# Altium project miniBackplane.PrjPCB (part 1 of 2)
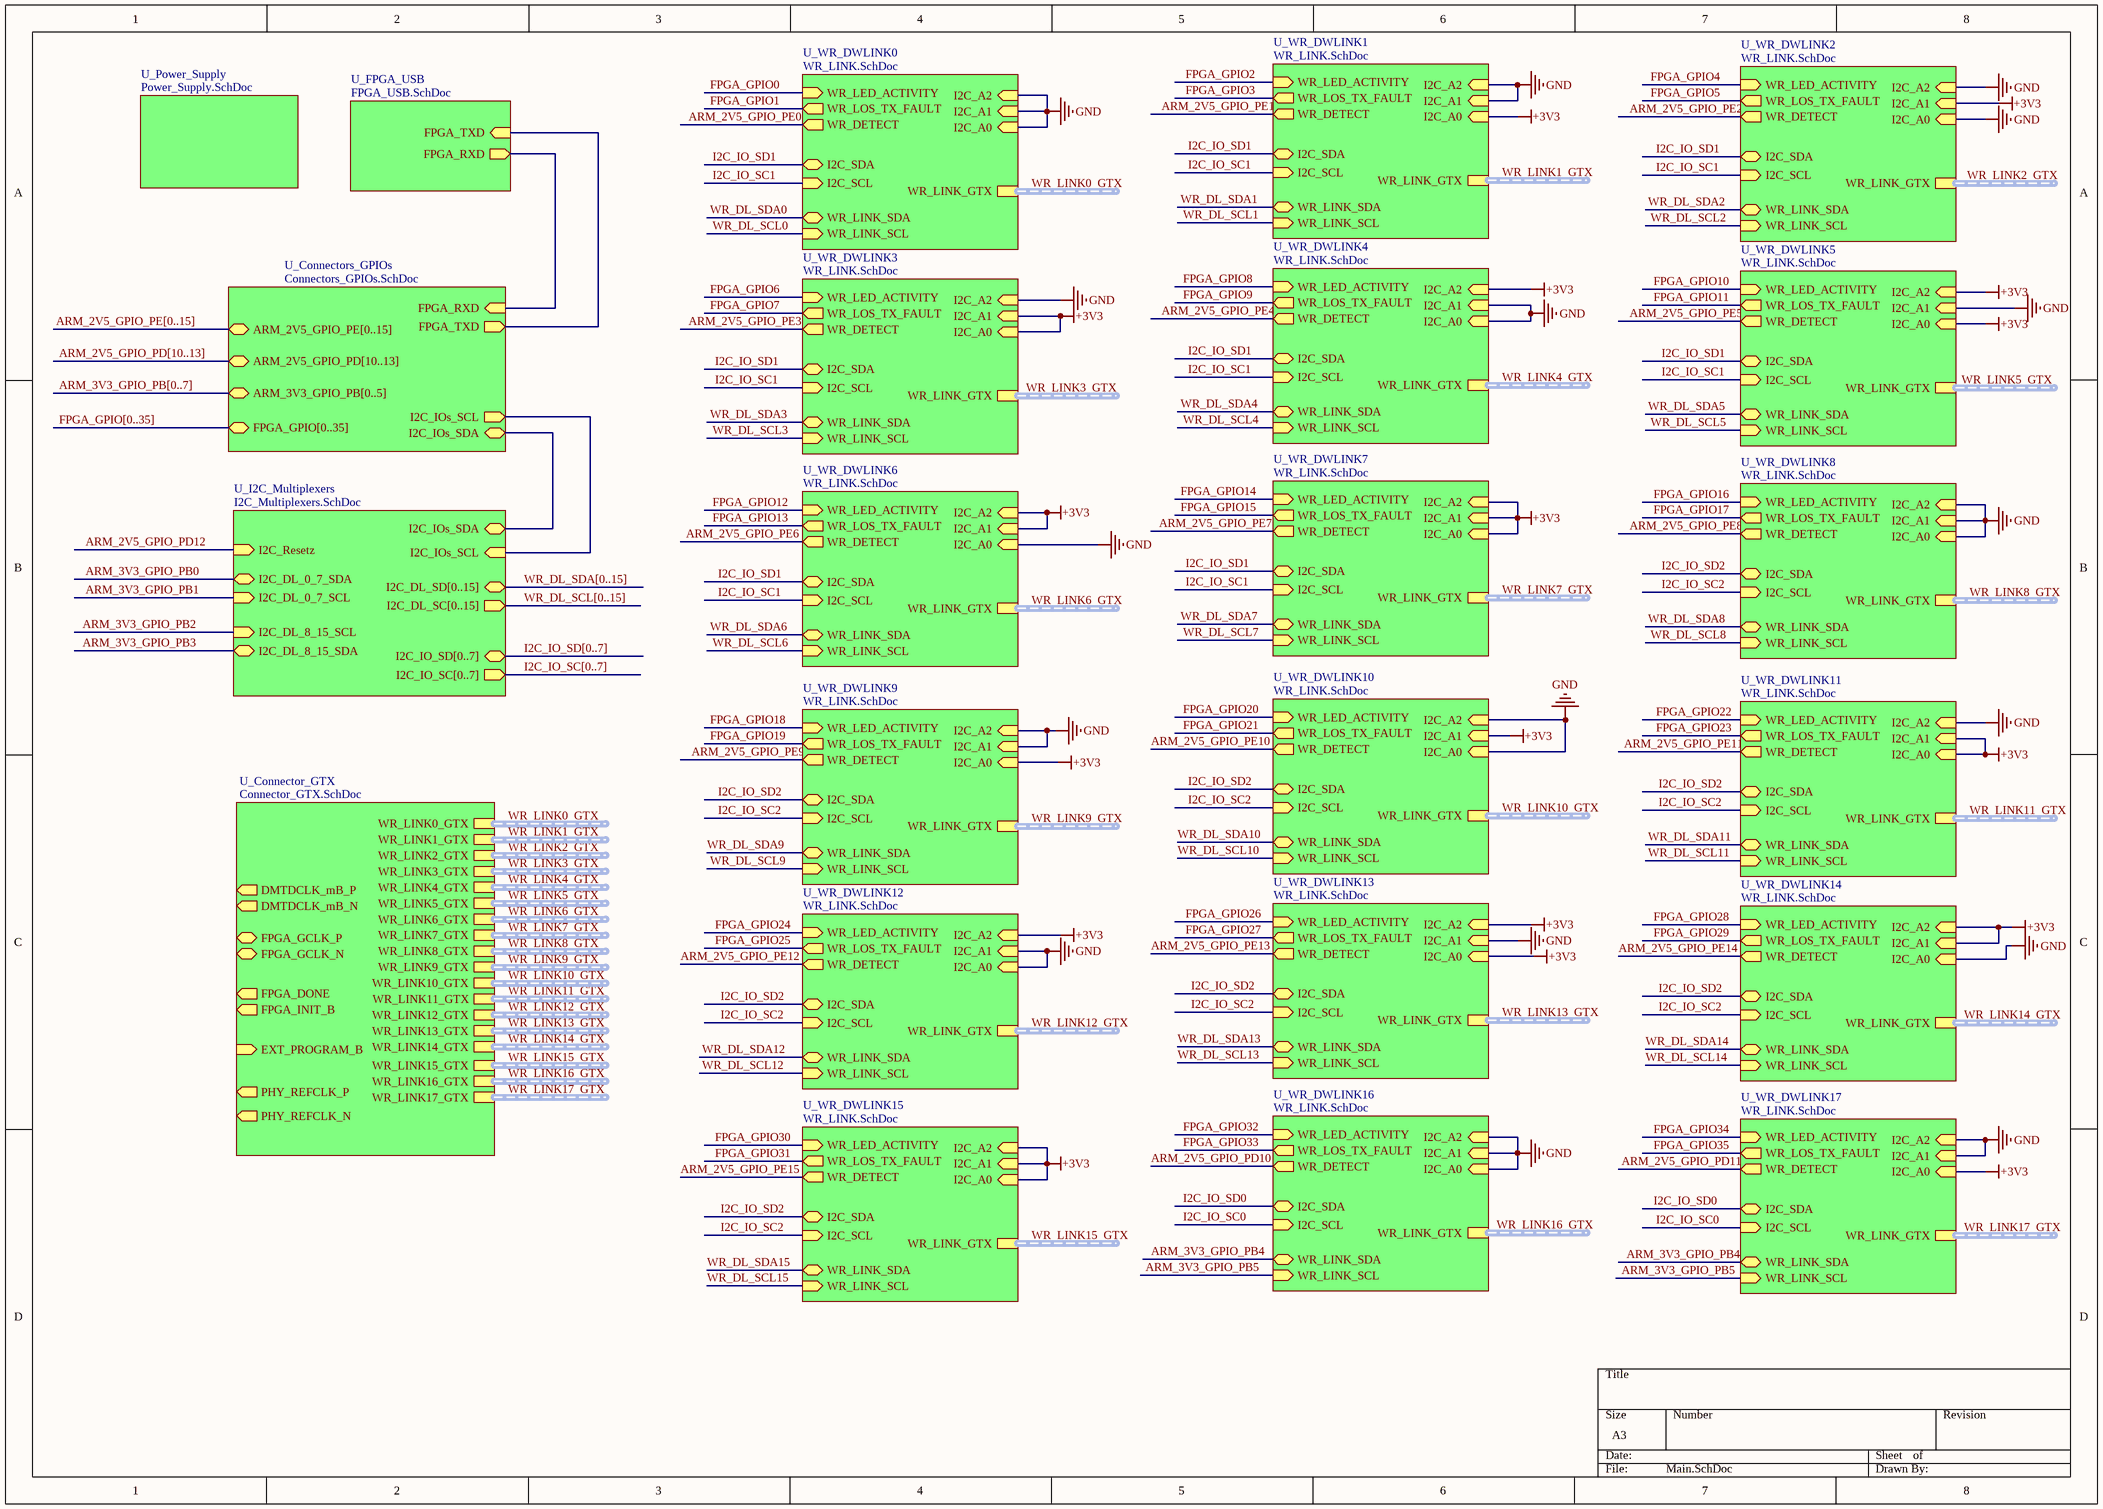
[diagram p0: Main.SchDoc]
8 sheets, 525 parts. Net scope: hierarchical (ports join the sheet entries above them; power ports are global).
Sheets:
  Main.SchDoc
    U_Connector_GTX = Connector_GTX.SchDoc
    U_WR_DWLINK0 = WR_LINK.SchDoc
      U_SFP = SFP.SchDoc
    U_I2C_Multiplexers = I2C_Multiplexers.SchDoc
    U_Connectors_GPIOs = Connectors_GPIOs.SchDoc
    U_Power_Supply = Power_Supply.SchDoc
    U_FPGA_USB = FPGA_USB.SchDoc
    U_WR_DWLINK1 = WR_LINK.SchDoc
      U_SFP = SFP.SchDoc
    U_WR_DWLINK2 = WR_LINK.SchDoc
      U_SFP = SFP.SchDoc
    U_WR_DWLINK3 = WR_LINK.SchDoc
      U_SFP = SFP.SchDoc
    U_WR_DWLINK4 = WR_LINK.SchDoc
      U_SFP = SFP.SchDoc
    U_WR_DWLINK5 = WR_LINK.SchDoc
      U_SFP = SFP.SchDoc
    U_WR_DWLINK8 = WR_LINK.SchDoc
      U_SFP = SFP.SchDoc
    U_WR_DWLINK11 = WR_LINK.SchDoc
      U_SFP = SFP.SchDoc
    U_WR_DWLINK14 = WR_LINK.SchDoc
      U_SFP = SFP.SchDoc
    U_WR_DWLINK17 = WR_LINK.SchDoc
      U_SFP = SFP.SchDoc
    U_WR_DWLINK16 = WR_LINK.SchDoc
      U_SFP = SFP.SchDoc
    U_WR_DWLINK13 = WR_LINK.SchDoc
      U_SFP = SFP.SchDoc
    U_WR_DWLINK10 = WR_LINK.SchDoc
      U_SFP = SFP.SchDoc
    U_WR_DWLINK7 = WR_LINK.SchDoc
      U_SFP = SFP.SchDoc
    U_WR_DWLINK6 = WR_LINK.SchDoc
      U_SFP = SFP.SchDoc
    U_WR_DWLINK9 = WR_LINK.SchDoc
      U_SFP = SFP.SchDoc
    U_WR_DWLINK12 = WR_LINK.SchDoc
      U_SFP = SFP.SchDoc
    U_WR_DWLINK15 = WR_LINK.SchDoc
      U_SFP = SFP.SchDoc

## Sheet Main.SchDoc
size A3

### Sub-sheets
U_Connector_GTX = Connector_GTX.SchDoc: DMTDCLK_mB_P (out), DMTDCLK_mB_N (out), FPGA_GCLK_P (bidir), FPGA_GCLK_N (bidir), EXT_PROGRAM_B (in), FPGA_DONE (out), FPGA_INIT_B (out), PHY_REFCLK_P (out), PHY_REFCLK_N (out), WR_LINK0_GTX (harness WR_LINK_GTX), WR_LINK1_GTX (harness WR_LINK_GTX), WR_LINK2_GTX (harness WR_LINK_GTX), WR_LINK3_GTX (harness WR_LINK_GTX), WR_LINK4_GTX (harness WR_LINK_GTX), WR_LINK5_GTX (harness WR_LINK_GTX), WR_LINK6_GTX (harness WR_LINK_GTX), WR_LINK7_GTX (harness WR_LINK_GTX), WR_LINK8_GTX (harness WR_LINK_GTX), WR_LINK9_GTX (harness WR_LINK_GTX), WR_LINK10_GTX (harness WR_LINK_GTX), WR_LINK11_GTX (harness WR_LINK_GTX), WR_LINK17_GTX (harness WR_LINK_GTX), WR_LINK16_GTX (harness WR_LINK_GTX), WR_LINK15_GTX (harness WR_LINK_GTX), WR_LINK14_GTX (harness WR_LINK_GTX), WR_LINK13_GTX (harness WR_LINK_GTX), WR_LINK12_GTX (harness WR_LINK_GTX)
U_Connectors_GPIOs = Connectors_GPIOs.SchDoc: FPGA_RXD (in), FPGA_TXD (out), ARM_2V5_GPIO_PE[0..15] (bidir), FPGA_GPIO[0..35] (bidir), I2C_IOs_SCL (out), I2C_IOs_SDA (bidir), ARM_2V5_GPIO_PD[10..13] (bidir), ARM_3V3_GPIO_PB[0..5] (bidir)
U_FPGA_USB = FPGA_USB.SchDoc: FPGA_RXD (out), FPGA_TXD (in)
U_I2C_Multiplexers = I2C_Multiplexers.SchDoc: I2C_DL_SD[0..15] (bidir), I2C_DL_SC[0..15] (out), I2C_IO_SD[0..7] (bidir), I2C_IO_SC[0..7] (out), I2C_DL_0_7_SDA (bidir), I2C_DL_0_7_SCL (in), I2C_DL_8_15_SCL (in), I2C_DL_8_15_SDA (bidir), I2C_IOs_SCL (in), I2C_IOs_SDA (bidir), I2C_Resetz (in)
U_Power_Supply = Power_Supply.SchDoc: no entries
U_WR_DWLINK0 = WR_LINK.SchDoc: WR_LINK_GTX (harness WR_LINK_GTX), I2C_A0 (in), I2C_A1 (in), I2C_A2 (in), I2C_SCL (in), I2C_SDA (bidir), WR_LINK_SDA (bidir), WR_LINK_SCL (in), WR_LOS_TX_FAULT (out), WR_LED_ACTIVITY (in), WR_DETECT (out)
U_WR_DWLINK1 = WR_LINK.SchDoc: WR_LINK_GTX (harness WR_LINK_GTX), I2C_A0 (in), I2C_A1 (in), I2C_A2 (in), I2C_SCL (in), I2C_SDA (bidir), WR_LINK_SDA (bidir), WR_LINK_SCL (in), WR_LOS_TX_FAULT (out), WR_LED_ACTIVITY (in), WR_DETECT (out)
U_WR_DWLINK2 = WR_LINK.SchDoc: WR_LINK_GTX (harness WR_LINK_GTX), I2C_A0 (in), I2C_A1 (in), I2C_A2 (in), I2C_SCL (in), I2C_SDA (bidir), WR_LINK_SDA (bidir), WR_LINK_SCL (in), WR_LOS_TX_FAULT (out), WR_LED_ACTIVITY (in), WR_DETECT (out)
U_WR_DWLINK3 = WR_LINK.SchDoc: WR_LINK_GTX (harness WR_LINK_GTX), I2C_A0 (in), I2C_A1 (in), I2C_A2 (in), I2C_SCL (in), I2C_SDA (bidir), WR_LINK_SDA (bidir), WR_LINK_SCL (in), WR_LOS_TX_FAULT (out), WR_LED_ACTIVITY (in), WR_DETECT (out)
U_WR_DWLINK4 = WR_LINK.SchDoc: WR_LINK_GTX (harness WR_LINK_GTX), I2C_A0 (in), I2C_A1 (in), I2C_A2 (in), I2C_SCL (in), I2C_SDA (bidir), WR_LINK_SDA (bidir), WR_LINK_SCL (in), WR_LOS_TX_FAULT (out), WR_LED_ACTIVITY (in), WR_DETECT (out)
U_WR_DWLINK5 = WR_LINK.SchDoc: WR_LINK_GTX (harness WR_LINK_GTX), I2C_A0 (in), I2C_A1 (in), I2C_A2 (in), I2C_SCL (in), I2C_SDA (bidir), WR_LINK_SDA (bidir), WR_LINK_SCL (in), WR_LOS_TX_FAULT (out), WR_LED_ACTIVITY (in), WR_DETECT (out)
U_WR_DWLINK6 = WR_LINK.SchDoc: WR_LINK_GTX (harness WR_LINK_GTX), I2C_A0 (in), I2C_A1 (in), I2C_A2 (in), I2C_SCL (in), I2C_SDA (bidir), WR_LINK_SDA (bidir), WR_LINK_SCL (in), WR_LOS_TX_FAULT (out), WR_LED_ACTIVITY (in), WR_DETECT (out)
U_WR_DWLINK7 = WR_LINK.SchDoc: WR_LINK_GTX (harness WR_LINK_GTX), I2C_A0 (in), I2C_A1 (in), I2C_A2 (in), I2C_SCL (in), I2C_SDA (bidir), WR_LINK_SDA (bidir), WR_LINK_SCL (in), WR_LOS_TX_FAULT (out), WR_LED_ACTIVITY (in), WR_DETECT (out)
U_WR_DWLINK8 = WR_LINK.SchDoc: WR_LINK_GTX (harness WR_LINK_GTX), I2C_A0 (in), I2C_A1 (in), I2C_A2 (in), I2C_SCL (in), I2C_SDA (bidir), WR_LINK_SDA (bidir), WR_LINK_SCL (in), WR_LOS_TX_FAULT (out), WR_LED_ACTIVITY (in), WR_DETECT (out)
U_WR_DWLINK9 = WR_LINK.SchDoc: WR_LINK_GTX (harness WR_LINK_GTX), I2C_A0 (in), I2C_A1 (in), I2C_A2 (in), I2C_SCL (in), I2C_SDA (bidir), WR_LINK_SDA (bidir), WR_LINK_SCL (in), WR_LOS_TX_FAULT (out), WR_LED_ACTIVITY (in), WR_DETECT (out)
U_WR_DWLINK10 = WR_LINK.SchDoc: WR_LINK_GTX (harness WR_LINK_GTX), I2C_A0 (in), I2C_A1 (in), I2C_A2 (in), I2C_SCL (in), I2C_SDA (bidir), WR_LINK_SDA (bidir), WR_LINK_SCL (in), WR_LOS_TX_FAULT (out), WR_LED_ACTIVITY (in), WR_DETECT (out)
U_WR_DWLINK11 = WR_LINK.SchDoc: WR_LINK_GTX (harness WR_LINK_GTX), I2C_A0 (in), I2C_A1 (in), I2C_A2 (in), I2C_SCL (in), I2C_SDA (bidir), WR_LINK_SDA (bidir), WR_LINK_SCL (in), WR_LOS_TX_FAULT (out), WR_LED_ACTIVITY (in), WR_DETECT (out)
U_WR_DWLINK12 = WR_LINK.SchDoc: WR_LINK_GTX (harness WR_LINK_GTX), I2C_A0 (in), I2C_A1 (in), I2C_A2 (in), I2C_SCL (in), I2C_SDA (bidir), WR_LINK_SDA (bidir), WR_LINK_SCL (in), WR_LOS_TX_FAULT (out), WR_LED_ACTIVITY (in), WR_DETECT (out)
U_WR_DWLINK13 = WR_LINK.SchDoc: WR_LINK_GTX (harness WR_LINK_GTX), I2C_A0 (in), I2C_A1 (in), I2C_A2 (in), I2C_SCL (in), I2C_SDA (bidir), WR_LINK_SDA (bidir), WR_LINK_SCL (in), WR_LOS_TX_FAULT (out), WR_LED_ACTIVITY (in), WR_DETECT (out)
U_WR_DWLINK14 = WR_LINK.SchDoc: WR_LINK_GTX (harness WR_LINK_GTX), I2C_A0 (in), I2C_A1 (in), I2C_A2 (in), I2C_SCL (in), I2C_SDA (bidir), WR_LINK_SDA (bidir), WR_LINK_SCL (in), WR_LOS_TX_FAULT (out), WR_LED_ACTIVITY (in), WR_DETECT (out)
U_WR_DWLINK15 = WR_LINK.SchDoc: WR_LINK_GTX (harness WR_LINK_GTX), I2C_A0 (in), I2C_A1 (in), I2C_A2 (in), I2C_SCL (in), I2C_SDA (bidir), WR_LINK_SDA (bidir), WR_LINK_SCL (in), WR_LOS_TX_FAULT (out), WR_LED_ACTIVITY (in), WR_DETECT (out)
U_WR_DWLINK16 = WR_LINK.SchDoc: WR_LINK_GTX (harness WR_LINK_GTX), I2C_A0 (in), I2C_A1 (in), I2C_A2 (in), I2C_SCL (in), I2C_SDA (bidir), WR_LINK_SDA (bidir), WR_LINK_SCL (in), WR_LOS_TX_FAULT (out), WR_LED_ACTIVITY (in), WR_DETECT (out)
U_WR_DWLINK17 = WR_LINK.SchDoc: WR_LINK_GTX (harness WR_LINK_GTX), I2C_A0 (in), I2C_A1 (in), I2C_A2 (in), I2C_SCL (in), I2C_SDA (bidir), WR_LINK_SDA (bidir), WR_LINK_SCL (in), WR_LOS_TX_FAULT (out), WR_LED_ACTIVITY (in), WR_DETECT (out)

### Nets
+3V3: sheet U_WR_DWLINK1/I2C_A0, sheet U_WR_DWLINK2/I2C_A1, sheet U_WR_DWLINK3/I2C_A0, sheet U_WR_DWLINK3/I2C_A1, sheet U_WR_DWLINK4/I2C_A2, sheet U_WR_DWLINK5/I2C_A0, sheet U_WR_DWLINK5/I2C_A2, sheet U_WR_DWLINK11/I2C_A0, sheet U_WR_DWLINK11/I2C_A1, sheet U_WR_DWLINK14/I2C_A1, sheet U_WR_DWLINK14/I2C_A2, sheet U_WR_DWLINK17/I2C_A0, sheet U_WR_DWLINK13/I2C_A0, sheet U_WR_DWLINK13/I2C_A2, sheet U_WR_DWLINK10/I2C_A1, sheet U_WR_DWLINK7/I2C_A0, sheet U_WR_DWLINK7/I2C_A1, sheet U_WR_DWLINK7/I2C_A2, sheet U_WR_DWLINK6/I2C_A1, sheet U_WR_DWLINK6/I2C_A2, sheet U_WR_DWLINK9/I2C_A0, sheet U_WR_DWLINK12/I2C_A2, sheet U_WR_DWLINK15/I2C_A0, sheet U_WR_DWLINK15/I2C_A1, sheet U_WR_DWLINK15/I2C_A2
GND: sheet U_WR_DWLINK0/I2C_A0, sheet U_WR_DWLINK0/I2C_A1, sheet U_WR_DWLINK0/I2C_A2, sheet U_WR_DWLINK1/I2C_A1, sheet U_WR_DWLINK1/I2C_A2, sheet U_WR_DWLINK2/I2C_A0, sheet U_WR_DWLINK2/I2C_A2, sheet U_WR_DWLINK3/I2C_A2, sheet U_WR_DWLINK4/I2C_A0, sheet U_WR_DWLINK4/I2C_A1, sheet U_WR_DWLINK5/I2C_A1, sheet U_WR_DWLINK8/I2C_A0, sheet U_WR_DWLINK8/I2C_A1, sheet U_WR_DWLINK8/I2C_A2, sheet U_WR_DWLINK11/I2C_A2, sheet U_WR_DWLINK14/I2C_A0, sheet U_WR_DWLINK17/I2C_A1, sheet U_WR_DWLINK17/I2C_A2, sheet U_WR_DWLINK16/I2C_A0, sheet U_WR_DWLINK16/I2C_A1, sheet U_WR_DWLINK16/I2C_A2, sheet U_WR_DWLINK13/I2C_A1, sheet U_WR_DWLINK10/I2C_A0, sheet U_WR_DWLINK10/I2C_A2, sheet U_WR_DWLINK6/I2C_A0, sheet U_WR_DWLINK9/I2C_A1, sheet U_WR_DWLINK9/I2C_A2, sheet U_WR_DWLINK12/I2C_A0, sheet U_WR_DWLINK12/I2C_A1
ARM_3V3_GPIO_PB4: sheet U_WR_DWLINK17/WR_LINK_SDA, sheet U_WR_DWLINK16/WR_LINK_SDA
ARM_3V3_GPIO_PB5: sheet U_WR_DWLINK17/WR_LINK_SCL, sheet U_WR_DWLINK16/WR_LINK_SCL
I2C_IO_SC0: sheet U_WR_DWLINK17/I2C_SCL, sheet U_WR_DWLINK16/I2C_SCL
I2C_IO_SC1: sheet U_WR_DWLINK0/I2C_SCL, sheet U_WR_DWLINK1/I2C_SCL, sheet U_WR_DWLINK2/I2C_SCL, sheet U_WR_DWLINK3/I2C_SCL, sheet U_WR_DWLINK4/I2C_SCL, sheet U_WR_DWLINK5/I2C_SCL, sheet U_WR_DWLINK7/I2C_SCL, sheet U_WR_DWLINK6/I2C_SCL
I2C_IO_SC2: sheet U_WR_DWLINK8/I2C_SCL, sheet U_WR_DWLINK11/I2C_SCL, sheet U_WR_DWLINK14/I2C_SCL, sheet U_WR_DWLINK13/I2C_SCL, sheet U_WR_DWLINK10/I2C_SCL, sheet U_WR_DWLINK9/I2C_SCL, sheet U_WR_DWLINK12/I2C_SCL, sheet U_WR_DWLINK15/I2C_SCL
I2C_IO_SD0: sheet U_WR_DWLINK17/I2C_SDA, sheet U_WR_DWLINK16/I2C_SDA
I2C_IO_SD1: sheet U_WR_DWLINK0/I2C_SDA, sheet U_WR_DWLINK1/I2C_SDA, sheet U_WR_DWLINK2/I2C_SDA, sheet U_WR_DWLINK3/I2C_SDA, sheet U_WR_DWLINK4/I2C_SDA, sheet U_WR_DWLINK5/I2C_SDA, sheet U_WR_DWLINK7/I2C_SDA, sheet U_WR_DWLINK6/I2C_SDA
I2C_IO_SD2: sheet U_WR_DWLINK8/I2C_SDA, sheet U_WR_DWLINK11/I2C_SDA, sheet U_WR_DWLINK14/I2C_SDA, sheet U_WR_DWLINK13/I2C_SDA, sheet U_WR_DWLINK10/I2C_SDA, sheet U_WR_DWLINK9/I2C_SDA, sheet U_WR_DWLINK12/I2C_SDA, sheet U_WR_DWLINK15/I2C_SDA
I2C_IOs_SCL: sheet U_I2C_Multiplexers/I2C_IOs_SCL, sheet U_Connectors_GPIOs/I2C_IOs_SCL
I2C_IOS_SDA: sheet U_I2C_Multiplexers/I2C_IOs_SDA, sheet U_Connectors_GPIOs/I2C_IOs_SDA
NetIC2_25: sheet U_Connectors_GPIOs/FPGA_TXD, sheet U_FPGA_USB/FPGA_TXD
NetJ2_78: sheet U_Connectors_GPIOs/FPGA_RXD, sheet U_FPGA_USB/FPGA_RXD

### Buses and harness runs
bus ARM_2V5_GPIO_PD[10..13] = sheet U_Connectors_GPIOs/ARM_2V5_GPIO_PD[10..13]
bus ARM_2V5_GPIO_PE[0..15] = sheet U_Connectors_GPIOs/ARM_2V5_GPIO_PE[0..15]
bus ARM_3V3_GPIO_PB[0..7] = sheet U_Connectors_GPIOs/ARM_3V3_GPIO_PB[0..5]
bus FPGA_GPIO[0..35] = sheet U_Connectors_GPIOs/FPGA_GPIO[0..35]
bus I2C_IO_SC[0..7] = sheet U_I2C_Multiplexers/I2C_IO_SC[0..7]
bus I2C_IO_SD[0..7] = sheet U_I2C_Multiplexers/I2C_IO_SD[0..7]
bus WR_DL_SCL[0..15] = sheet U_I2C_Multiplexers/I2C_DL_SC[0..15]
bus WR_DL_SDA[0..15] = sheet U_I2C_Multiplexers/I2C_DL_SD[0..15]
harness WR_LINK0_GTX = sheet U_Connector_GTX/WR_LINK0_GTX
harness WR_LINK0_GTX = sheet U_WR_DWLINK0/WR_LINK_GTX
harness WR_LINK1_GTX = sheet U_Connector_GTX/WR_LINK1_GTX
harness WR_LINK1_GTX = sheet U_WR_DWLINK1/WR_LINK_GTX
harness WR_LINK2_GTX = sheet U_Connector_GTX/WR_LINK2_GTX
harness WR_LINK2_GTX = sheet U_WR_DWLINK2/WR_LINK_GTX
harness WR_LINK3_GTX = sheet U_Connector_GTX/WR_LINK3_GTX
harness WR_LINK3_GTX = sheet U_WR_DWLINK3/WR_LINK_GTX
harness WR_LINK4_GTX = sheet U_Connector_GTX/WR_LINK4_GTX
harness WR_LINK4_GTX = sheet U_WR_DWLINK4/WR_LINK_GTX
harness WR_LINK5_GTX = sheet U_Connector_GTX/WR_LINK5_GTX
harness WR_LINK5_GTX = sheet U_WR_DWLINK5/WR_LINK_GTX
harness WR_LINK6_GTX = sheet U_Connector_GTX/WR_LINK6_GTX
harness WR_LINK6_GTX = sheet U_WR_DWLINK6/WR_LINK_GTX
harness WR_LINK7_GTX = sheet U_Connector_GTX/WR_LINK7_GTX
harness WR_LINK7_GTX = sheet U_WR_DWLINK7/WR_LINK_GTX
harness WR_LINK8_GTX = sheet U_Connector_GTX/WR_LINK8_GTX
harness WR_LINK8_GTX = sheet U_WR_DWLINK8/WR_LINK_GTX
harness WR_LINK9_GTX = sheet U_Connector_GTX/WR_LINK9_GTX
harness WR_LINK9_GTX = sheet U_WR_DWLINK9/WR_LINK_GTX
harness WR_LINK10_GTX = sheet U_Connector_GTX/WR_LINK10_GTX
harness WR_LINK10_GTX = sheet U_WR_DWLINK10/WR_LINK_GTX
harness WR_LINK11_GTX = sheet U_Connector_GTX/WR_LINK11_GTX
harness WR_LINK11_GTX = sheet U_WR_DWLINK11/WR_LINK_GTX
harness WR_LINK12_GTX = sheet U_Connector_GTX/WR_LINK12_GTX
harness WR_LINK12_GTX = sheet U_WR_DWLINK12/WR_LINK_GTX
harness WR_LINK13_GTX = sheet U_Connector_GTX/WR_LINK13_GTX
harness WR_LINK13_GTX = sheet U_WR_DWLINK13/WR_LINK_GTX
harness WR_LINK14_GTX = sheet U_Connector_GTX/WR_LINK14_GTX
harness WR_LINK14_GTX = sheet U_WR_DWLINK14/WR_LINK_GTX
harness WR_LINK15_GTX = sheet U_Connector_GTX/WR_LINK15_GTX
harness WR_LINK15_GTX = sheet U_WR_DWLINK15/WR_LINK_GTX
harness WR_LINK16_GTX = sheet U_Connector_GTX/WR_LINK16_GTX
harness WR_LINK16_GTX = sheet U_WR_DWLINK16/WR_LINK_GTX
harness WR_LINK17_GTX = sheet U_Connector_GTX/WR_LINK17_GTX
harness WR_LINK17_GTX = sheet U_WR_DWLINK17/WR_LINK_GTX

## Sheet Connector_GTX.SchDoc
size A3
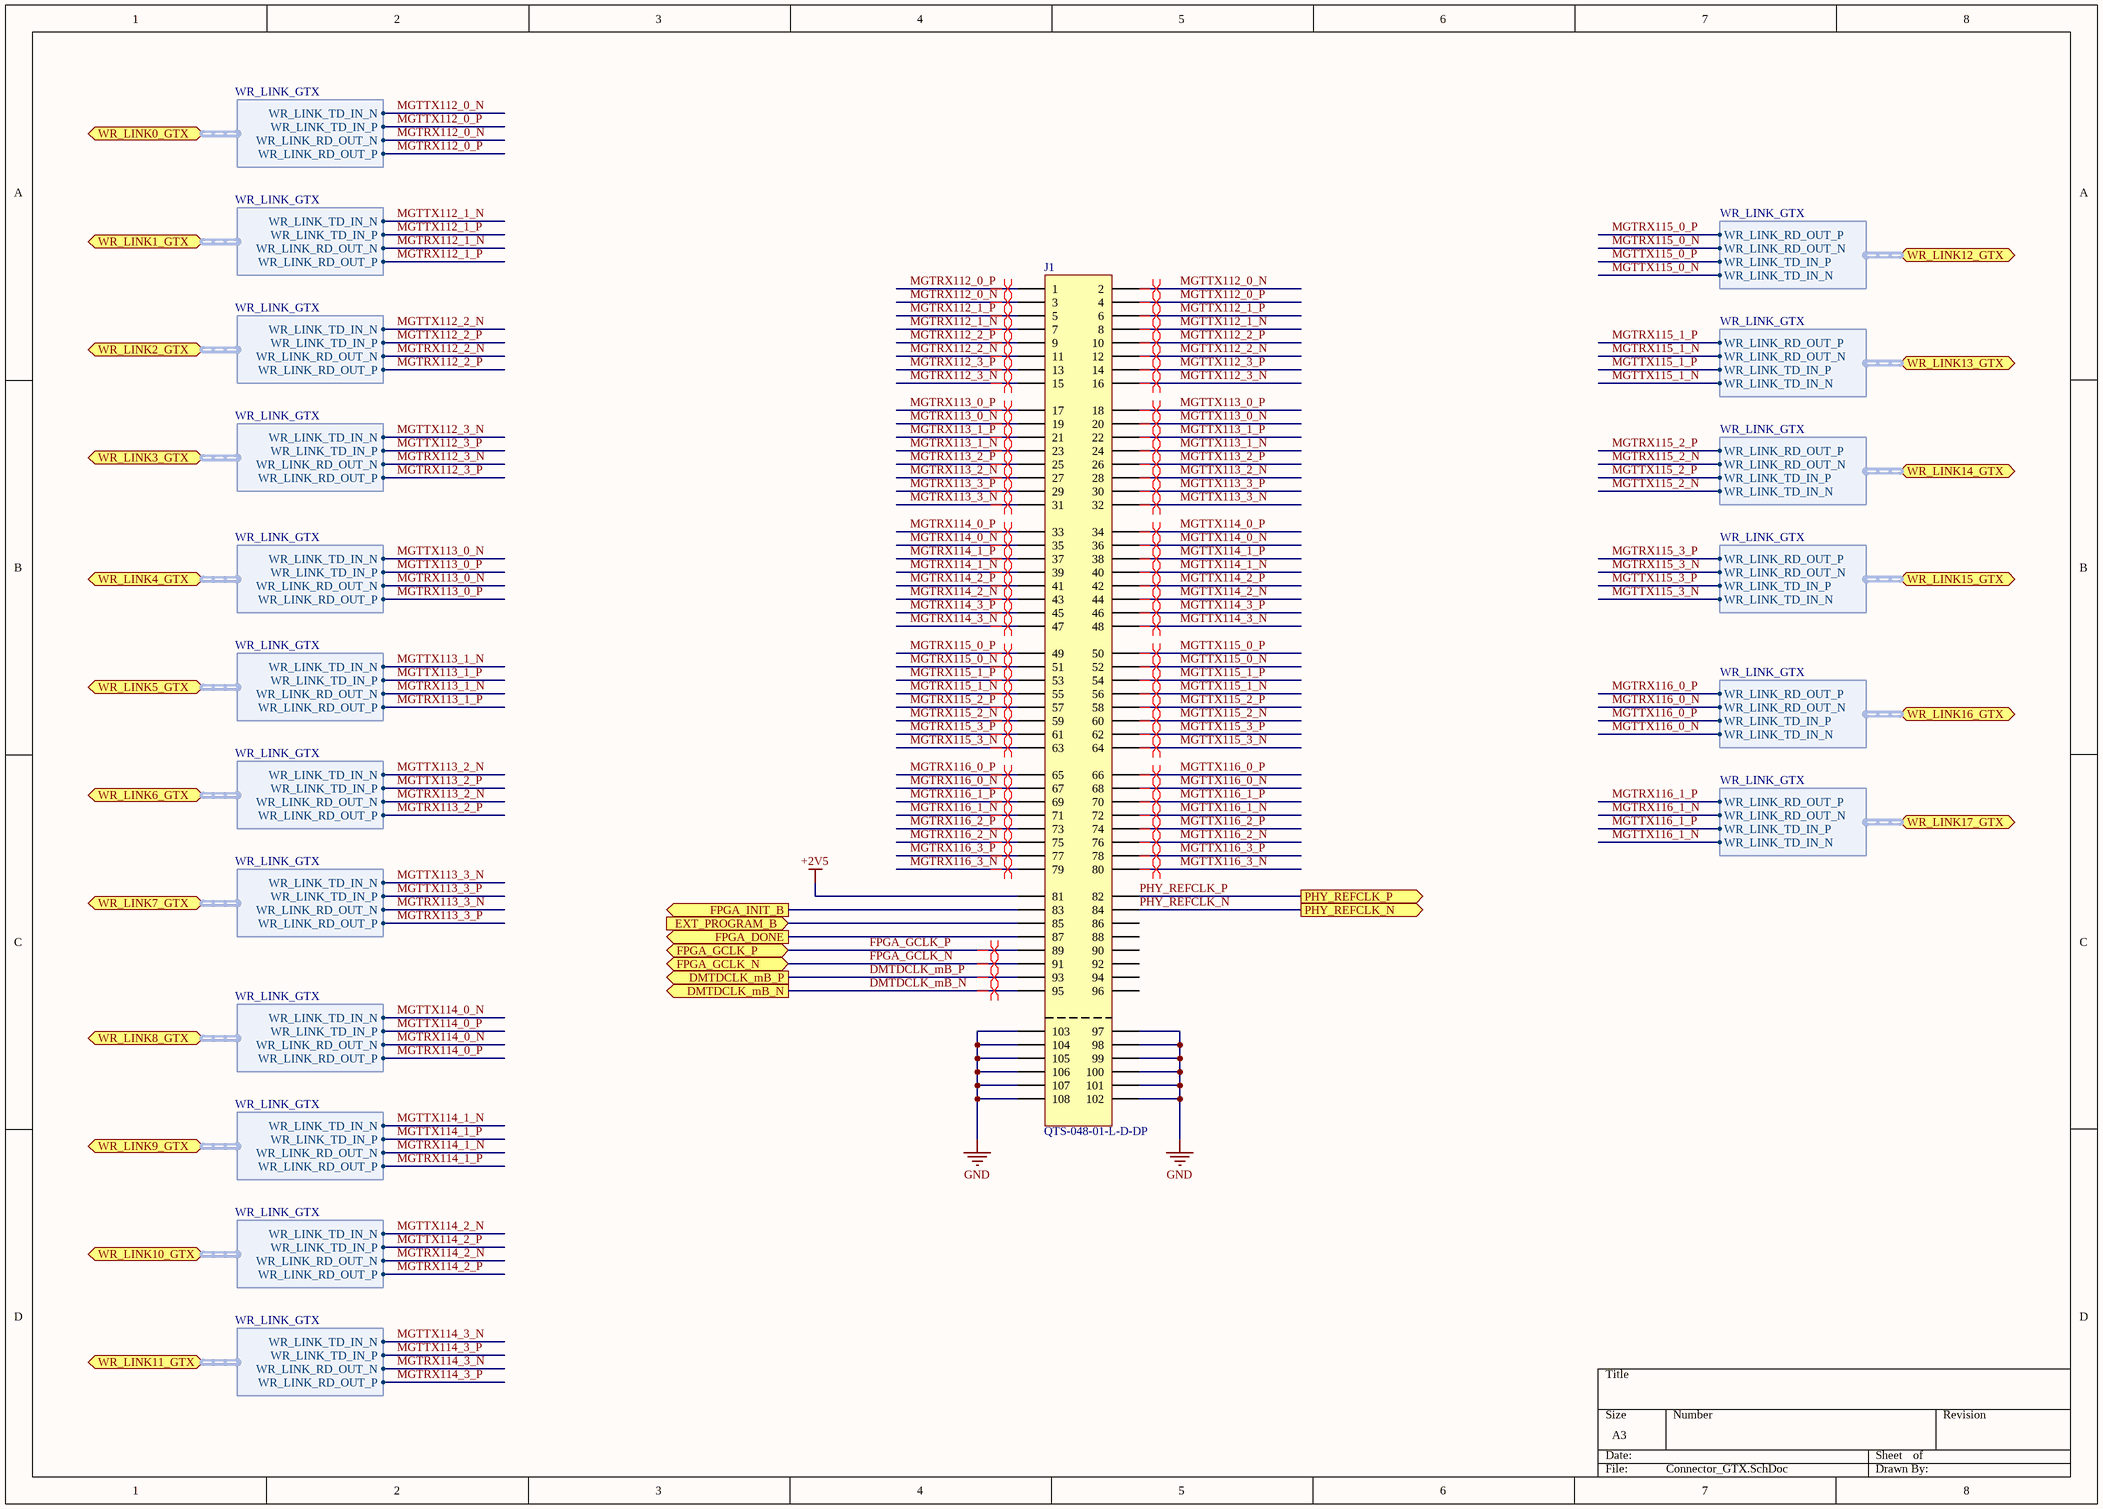
[diagram p1: Connector_GTX.SchDoc]

### Parts
J1  QTS-048-01-L-D-DP  [QTS-048-XX-X-D-DP-A]

### Ports
DMTDCLK_mB_N (out), DMTDCLK_mB_P (out), EXT_PROGRAM_B (in), FPGA_DONE (out), FPGA_GCLK_N (bidir), FPGA_GCLK_P (bidir), FPGA_INIT_B (out), PHY_REFCLK_N (out), PHY_REFCLK_P (out), WR_LINK0_GTX (harness WR_LINK_GTX), WR_LINK1_GTX (harness WR_LINK_GTX), WR_LINK2_GTX (harness WR_LINK_GTX), WR_LINK3_GTX (harness WR_LINK_GTX), WR_LINK4_GTX (harness WR_LINK_GTX), WR_LINK5_GTX (harness WR_LINK_GTX), WR_LINK6_GTX (harness WR_LINK_GTX), WR_LINK7_GTX (harness WR_LINK_GTX), WR_LINK8_GTX (harness WR_LINK_GTX), WR_LINK9_GTX (harness WR_LINK_GTX), WR_LINK10_GTX (harness WR_LINK_GTX), WR_LINK11_GTX (harness WR_LINK_GTX), WR_LINK12_GTX (harness WR_LINK_GTX), WR_LINK13_GTX (harness WR_LINK_GTX), WR_LINK14_GTX (harness WR_LINK_GTX), WR_LINK15_GTX (harness WR_LINK_GTX), WR_LINK16_GTX (harness WR_LINK_GTX), WR_LINK17_GTX (harness WR_LINK_GTX)

### Harnesses
WR_LINK_GTX: WR_LINK_TD_IN_N, WR_LINK_TD_IN_P, WR_LINK_RD_OUT_N, WR_LINK_RD_OUT_P

### Nets
+2V5: J1.81
GND: J1.97 J1.98 J1.99 J1.100 J1.101 J1.102 J1.103 J1.104 J1.105 J1.106 J1.107 J1.108
DMTDCLK_mB_N: J1.95 ; port DMTDCLK_mB_N
DMTDCLK_mB_P: J1.93 ; port DMTDCLK_mB_P
FPGA_GCLK_N: J1.91 ; port FPGA_GCLK_N
FPGA_GCLK_P: J1.89 ; port FPGA_GCLK_P
MGTRX112_0_N: J1.3 ; port WR_LINK0_GTX.WR_LINK_RD_OUT_N
MGTRX112_0_P: J1.1 ; port WR_LINK0_GTX.WR_LINK_RD_OUT_P
MGTRX112_1_N: J1.7 ; port WR_LINK1_GTX.WR_LINK_RD_OUT_N
MGTRX112_1_P: J1.5 ; port WR_LINK1_GTX.WR_LINK_RD_OUT_P
MGTRX112_2_N: J1.11 ; port WR_LINK2_GTX.WR_LINK_RD_OUT_N
MGTRX112_2_P: J1.9 ; port WR_LINK2_GTX.WR_LINK_RD_OUT_P
MGTRX112_3_N: J1.15 ; port WR_LINK3_GTX.WR_LINK_RD_OUT_N
MGTRX112_3_P: J1.13 ; port WR_LINK3_GTX.WR_LINK_RD_OUT_P
MGTRX113_0_N: J1.19 ; port WR_LINK4_GTX.WR_LINK_RD_OUT_N
MGTRX113_0_P: J1.17 ; port WR_LINK4_GTX.WR_LINK_RD_OUT_P
MGTRX113_1_N: J1.23 ; port WR_LINK5_GTX.WR_LINK_RD_OUT_N
MGTRX113_1_P: J1.21 ; port WR_LINK5_GTX.WR_LINK_RD_OUT_P
MGTRX113_2_N: J1.27 ; port WR_LINK6_GTX.WR_LINK_RD_OUT_N
MGTRX113_2_P: J1.25 ; port WR_LINK6_GTX.WR_LINK_RD_OUT_P
MGTRX113_3_N: J1.31 ; port WR_LINK7_GTX.WR_LINK_RD_OUT_N
MGTRX113_3_P: J1.29 ; port WR_LINK7_GTX.WR_LINK_RD_OUT_P
MGTRX114_0_N: J1.35 ; port WR_LINK8_GTX.WR_LINK_RD_OUT_N
MGTRX114_0_P: J1.33 ; port WR_LINK8_GTX.WR_LINK_RD_OUT_P
MGTRX114_1_N: J1.39 ; port WR_LINK9_GTX.WR_LINK_RD_OUT_N
MGTRX114_1_P: J1.37 ; port WR_LINK9_GTX.WR_LINK_RD_OUT_P
MGTRX114_2_N: J1.43 ; port WR_LINK10_GTX.WR_LINK_RD_OUT_N
MGTRX114_2_P: J1.41 ; port WR_LINK10_GTX.WR_LINK_RD_OUT_P
MGTRX114_3_N: J1.47 ; port WR_LINK11_GTX.WR_LINK_RD_OUT_N
MGTRX114_3_P: J1.45 ; port WR_LINK11_GTX.WR_LINK_RD_OUT_P
MGTRX115_0_N: J1.51 ; port WR_LINK12_GTX.WR_LINK_RD_OUT_N
MGTRX115_0_P: J1.49 ; port WR_LINK12_GTX.WR_LINK_RD_OUT_P
MGTRX115_1_N: J1.55 ; port WR_LINK13_GTX.WR_LINK_RD_OUT_N
MGTRX115_1_P: J1.53 ; port WR_LINK13_GTX.WR_LINK_RD_OUT_P
MGTRX115_2_N: J1.59 ; port WR_LINK14_GTX.WR_LINK_RD_OUT_N
MGTRX115_2_P: J1.57 ; port WR_LINK14_GTX.WR_LINK_RD_OUT_P
MGTRX115_3_N: J1.63 ; port WR_LINK15_GTX.WR_LINK_RD_OUT_N
MGTRX115_3_P: J1.61 ; port WR_LINK15_GTX.WR_LINK_RD_OUT_P
MGTRX116_0_N: J1.67 ; port WR_LINK16_GTX.WR_LINK_RD_OUT_N
MGTRX116_0_P: J1.65 ; port WR_LINK16_GTX.WR_LINK_RD_OUT_P
MGTRX116_1_N: J1.71 ; port WR_LINK17_GTX.WR_LINK_RD_OUT_N
MGTRX116_1_P: J1.69 ; port WR_LINK17_GTX.WR_LINK_RD_OUT_P
MGTRX116_2_N: J1.75
MGTRX116_2_P: J1.73
MGTRX116_3_N: J1.79
MGTRX116_3_P: J1.77
MGTTX112_0_N: J1.2 ; port WR_LINK0_GTX.WR_LINK_TD_IN_N
MGTTX112_0_P: J1.4 ; port WR_LINK0_GTX.WR_LINK_TD_IN_P
MGTTX112_1_N: J1.8 ; port WR_LINK1_GTX.WR_LINK_TD_IN_N
MGTTX112_1_P: J1.6 ; port WR_LINK1_GTX.WR_LINK_TD_IN_P
MGTTX112_2_N: J1.12 ; port WR_LINK2_GTX.WR_LINK_TD_IN_N
MGTTX112_2_P: J1.10 ; port WR_LINK2_GTX.WR_LINK_TD_IN_P
MGTTX112_3_N: J1.16 ; port WR_LINK3_GTX.WR_LINK_TD_IN_N
MGTTX112_3_P: J1.14 ; port WR_LINK3_GTX.WR_LINK_TD_IN_P
MGTTX113_0_N: J1.20 ; port WR_LINK4_GTX.WR_LINK_TD_IN_N
MGTTX113_0_P: J1.18 ; port WR_LINK4_GTX.WR_LINK_TD_IN_P
MGTTX113_1_N: J1.24 ; port WR_LINK5_GTX.WR_LINK_TD_IN_N
MGTTX113_1_P: J1.22 ; port WR_LINK5_GTX.WR_LINK_TD_IN_P
MGTTX113_2_N: J1.28 ; port WR_LINK6_GTX.WR_LINK_TD_IN_N
MGTTX113_2_P: J1.26 ; port WR_LINK6_GTX.WR_LINK_TD_IN_P
MGTTX113_3_N: J1.32 ; port WR_LINK7_GTX.WR_LINK_TD_IN_N
MGTTX113_3_P: J1.30 ; port WR_LINK7_GTX.WR_LINK_TD_IN_P
MGTTX114_0_N: J1.36 ; port WR_LINK8_GTX.WR_LINK_TD_IN_N
MGTTX114_0_P: J1.34 ; port WR_LINK8_GTX.WR_LINK_TD_IN_P
MGTTX114_1_N: J1.40 ; port WR_LINK9_GTX.WR_LINK_TD_IN_N
MGTTX114_1_P: J1.38 ; port WR_LINK9_GTX.WR_LINK_TD_IN_P
MGTTX114_2_N: J1.44 ; port WR_LINK10_GTX.WR_LINK_TD_IN_N
MGTTX114_2_P: J1.42 ; port WR_LINK10_GTX.WR_LINK_TD_IN_P
MGTTX114_3_N: J1.48 ; port WR_LINK11_GTX.WR_LINK_TD_IN_N
MGTTX114_3_P: J1.46 ; port WR_LINK11_GTX.WR_LINK_TD_IN_P
MGTTX115_0_N: J1.52 ; port WR_LINK12_GTX.WR_LINK_TD_IN_N
MGTTX115_0_P: J1.50 ; port WR_LINK12_GTX.WR_LINK_TD_IN_P
MGTTX115_1_N: J1.56 ; port WR_LINK13_GTX.WR_LINK_TD_IN_N
MGTTX115_1_P: J1.54 ; port WR_LINK13_GTX.WR_LINK_TD_IN_P
MGTTX115_2_N: J1.60 ; port WR_LINK14_GTX.WR_LINK_TD_IN_N
MGTTX115_2_P: J1.58 ; port WR_LINK14_GTX.WR_LINK_TD_IN_P
MGTTX115_3_N: J1.64 ; port WR_LINK15_GTX.WR_LINK_TD_IN_N
MGTTX115_3_P: J1.62 ; port WR_LINK15_GTX.WR_LINK_TD_IN_P
MGTTX116_0_N: J1.68 ; port WR_LINK16_GTX.WR_LINK_TD_IN_N
MGTTX116_0_P: J1.66 ; port WR_LINK16_GTX.WR_LINK_TD_IN_P
MGTTX116_1_N: J1.72 ; port WR_LINK17_GTX.WR_LINK_TD_IN_N
MGTTX116_1_P: J1.70 ; port WR_LINK17_GTX.WR_LINK_TD_IN_P
MGTTX116_2_N: J1.76
MGTTX116_2_P: J1.74
MGTTX116_3_N: J1.80
MGTTX116_3_P: J1.78
PHY_REFCLK_N: J1.84 ; port PHY_REFCLK_N
PHY_REFCLK_P: J1.82 ; port PHY_REFCLK_P
NetJ1_83: J1.83 ; port FPGA_INIT_B
NetJ1_85: J1.85 ; port EXT_PROGRAM_B
NetJ1_87: J1.87 ; port FPGA_DONE

Not connected (* = marked no-connect by the designer): J1 86 88 90 92 94 96

### Layout directives
differential pair: DMTDCLK_mB_N, DMTDCLK_mB_P, FPGA_GCLK_N, FPGA_GCLK_P, MGTRX112_0_N, MGTRX112_0_P, MGTRX112_1_N, MGTRX112_1_P, MGTRX112_2_N, MGTRX112_2_P, MGTRX112_3_N, MGTRX112_3_P, MGTRX113_0_N, MGTRX113_0_P, MGTRX113_1_N, MGTRX113_1_P, MGTRX113_2_N, MGTRX113_2_P, MGTRX113_3_N, MGTRX113_3_P, MGTRX114_0_N, MGTRX114_0_P, MGTRX114_1_N, MGTRX114_1_P, MGTRX114_2_N, MGTRX114_2_P, MGTRX114_3_N, MGTRX114_3_P, MGTRX115_0_N, MGTRX115_0_P, MGTRX115_1_N, MGTRX115_1_P, MGTRX115_2_N, MGTRX115_2_P, MGTRX115_3_N, MGTRX115_3_P, MGTRX116_0_N, MGTRX116_0_P, MGTRX116_1_N, MGTRX116_1_P, MGTRX116_2_N, MGTRX116_2_P, MGTRX116_3_N, MGTRX116_3_P, MGTTX112_0_N, MGTTX112_0_P, MGTTX112_1_N, MGTTX112_1_P, MGTTX112_2_N, MGTTX112_2_P, MGTTX112_3_N, MGTTX112_3_P, MGTTX113_0_N, MGTTX113_0_P, MGTTX113_1_N, MGTTX113_1_P, MGTTX113_2_N, MGTTX113_2_P, MGTTX113_3_N, MGTTX113_3_P, MGTTX114_0_N, MGTTX114_0_P, MGTTX114_1_N, MGTTX114_1_P, MGTTX114_2_N, MGTTX114_2_P, MGTTX114_3_N, MGTTX114_3_P, MGTTX115_0_N, MGTTX115_0_P, MGTTX115_1_N, MGTTX115_1_P, MGTTX115_2_N, MGTTX115_2_P, MGTTX115_3_N, MGTTX115_3_P, MGTTX116_0_N, MGTTX116_0_P, MGTTX116_1_N, MGTTX116_1_P, MGTTX116_2_N, MGTTX116_2_P, MGTTX116_3_N, MGTTX116_3_P

### Library data of the parts
J1 = QTS-048-01-L-D-DP: High Speed Ground Plane Header; Manufacturer1: Samtec; Manufacturer1 PN: QTS-048-01-L-D-DP

## Sheet WR_LINK.SchDoc
size A4
Used 18 times, as channels U_WR_DWLINK0, U_WR_DWLINK1, U_WR_DWLINK2, U_WR_DWLINK3, U_WR_DWLINK4, U_WR_DWLINK5, U_WR_DWLINK8, U_WR_DWLINK11, U_WR_DWLINK14, U_WR_DWLINK17, U_WR_DWLINK16, U_WR_DWLINK13, U_WR_DWLINK10, U_WR_DWLINK7, U_WR_DWLINK6, U_WR_DWLINK9, U_WR_DWLINK12, U_WR_DWLINK15. Parts and nets are listed once, with the designators drawn on the sheet.
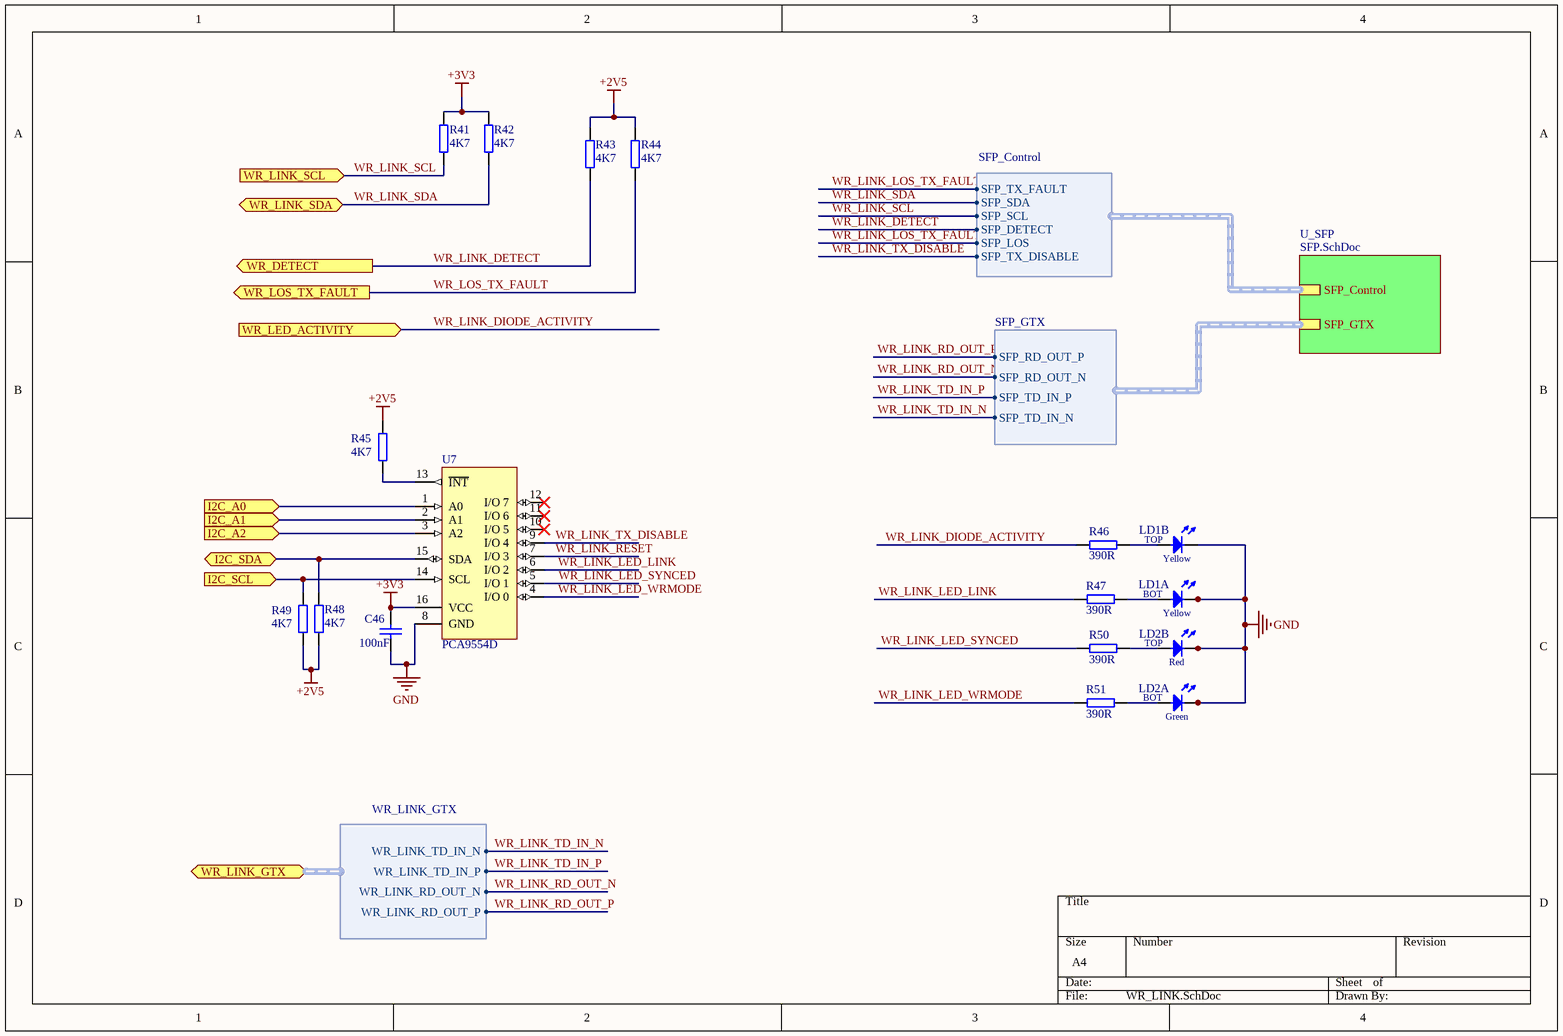
[diagram p2: WR_LINK.SchDoc]

### Parts
C46  100nF  [CC1608-0603]
LD1  Yellow/Yellow  [LED_DIALIGHT_571-0133-100F]  (value not drawn)  (parts A,B of 2)
LD2  Green/Yellow  [LED_DIALIGHT_571-0132-100F]  (value not drawn)  (parts A,B of 2)
R41  4K7  [0402]
R42  4K7  [0402]
R43  4K7  [0402]
R44  4K7  [0402]
R45  4K7  [0603]
R46  390R  [0603]
R47  390R  [0603]
R48  4K7  [0603]
R49  4K7  [0603]
R50  390R  [0603]
R51  390R  [0603]
U7  PCA9554D  [SOP65P640X110-20N]

### Sub-sheets
U_SFP = SFP.SchDoc: SFP_Control (harness SFP_Control), SFP_GTX (harness SFP_GTX)

### Ports
I2C_A0 (in), I2C_A1 (in), I2C_A2 (in), I2C_SCL (in), I2C_SDA (bidir), WR_DETECT (out), WR_LED_ACTIVITY (in), WR_LINK_GTX (harness WR_LINK_GTX), WR_LINK_SCL (in), WR_LINK_SDA (bidir), WR_LOS_TX_FAULT (out)

### Harnesses
WR_LINK_GTX: WR_LINK_TD_IN_N, WR_LINK_TD_IN_P, WR_LINK_RD_OUT_N, WR_LINK_RD_OUT_P
SFP_GTX: SFP_TD_IN_N, SFP_TD_IN_P, SFP_RD_OUT_N, SFP_RD_OUT_P
SFP_Control: SFP_DETECT, SFP_LOS, SFP_SCL, SFP_SDA, SFP_TX_FAULT, SFP_TX_DISABLE

### Nets
+2V5: R43.2 R44.2 R45.2 R48.2 R49.1
+3V3: C46.1 R41.2 R42.2 U7.16(VCC)
GND: C46.2 LD1.1(C) LD1.3(C) LD2.1(C) LD2.3(C) U7.8(GND)
I2C_A0: U7.1(A0) ; port I2C_A0
I2C_A1: U7.2(A1) ; port I2C_A1
I2C_A2: U7.3(A2) ; port I2C_A2
I2C_SCL: R49.2 U7.14(SCL) ; port I2C_SCL
I2C_SDA: R48.1 U7.15(SDA) ; port I2C_SDA
WR_LINK_DETECT: R43.1 ; port WR_DETECT, sheet U_SFP/SFP_Control.SFP_DETECT
WR_LINK_DIODE_ACTIVITY: R46.2 ; port WR_LED_ACTIVITY
WR_LINK_LED_LINK: R47.2 U7.6(I/O_2)
WR_LINK_LED_SYNCED: R50.2 U7.5(I/O_1)
WR_LINK_LED_WRMODE: R51.2 U7.4(I/O_0)
WR_LINK_LOS_TX_FAULT: sheet U_SFP/SFP_Control.SFP_LOS, sheet U_SFP/SFP_Control.SFP_TX_FAULT
WR_LINK_RD_OUT_N: port WR_LINK_GTX.WR_LINK_RD_OUT_N, sheet U_SFP/SFP_GTX.SFP_RD_OUT_N
WR_LINK_RD_OUT_P: port WR_LINK_GTX.WR_LINK_RD_OUT_P, sheet U_SFP/SFP_GTX.SFP_RD_OUT_P
WR_LINK_RESET: U7.7(I/O_3)
WR_LINK_SCL: R41.1 ; port WR_LINK_SCL, sheet U_SFP/SFP_Control.SFP_SCL
WR_LINK_SDA: R42.1 ; port WR_LINK_SDA, sheet U_SFP/SFP_Control.SFP_SDA
WR_LINK_TD_IN_N: port WR_LINK_GTX.WR_LINK_TD_IN_N, sheet U_SFP/SFP_GTX.SFP_TD_IN_N
WR_LINK_TD_IN_P: port WR_LINK_GTX.WR_LINK_TD_IN_P, sheet U_SFP/SFP_GTX.SFP_TD_IN_P
WR_LINK_TX_DISABLE: U7.9(I/O_4) ; sheet U_SFP/SFP_Control.SFP_TX_DISABLE
WR_LOS_TX_FAULT: R44.1 ; port WR_LOS_TX_FAULT
NetLD1_2: LD1.2(A) R47.1
NetLD1_4: LD1.4(A) R46.1
NetLD2_2: LD2.2(A) R51.1
NetLD2_4: LD2.4(A) R50.1
NetR45_1: R45.1 U7.13(~{INT})

Not connected (* = marked no-connect by the designer): U7 10(I/O_5)* 11(I/O_6)* 12(I/O_7)*

### Channels
U_WR_DWLINK0: designators end in _U_WR_DWLINK0; ports I2C_A0=GND I2C_A1=GND I2C_A2=GND I2C_SCL=I2C_IO_SC1 I2C_SDA=I2C_IO_SD1 WR_DETECT=ARM_2V5_GPIO_PE0 WR_LED_ACTIVITY=FPGA_GPIO0 WR_LINK_SCL=I2C_DL_SC0 WR_LINK_SDA=I2C_DL_SD0 WR_LOS_TX_FAULT=FPGA_GPIO1
U_WR_DWLINK1: designators end in _U_WR_DWLINK1; ports I2C_A0=+3V3 I2C_A1=GND I2C_A2=GND I2C_SCL=I2C_IO_SC1 I2C_SDA=I2C_IO_SD1 WR_DETECT=ARM_2V5_GPIO_PE1 WR_LED_ACTIVITY=FPGA_GPIO2 WR_LINK_SCL=I2C_DL_SC1 WR_LINK_SDA=I2C_DL_SD1 WR_LOS_TX_FAULT=FPGA_GPIO3
U_WR_DWLINK2: designators end in _U_WR_DWLINK2; ports I2C_A0=GND I2C_A1=+3V3 I2C_A2=GND I2C_SCL=I2C_IO_SC1 I2C_SDA=I2C_IO_SD1 WR_DETECT=ARM_2V5_GPIO_PE2 WR_LED_ACTIVITY=FPGA_GPIO4 WR_LINK_SCL=I2C_DL_SC2 WR_LINK_SDA=I2C_DL_SD2 WR_LOS_TX_FAULT=FPGA_GPIO5
U_WR_DWLINK3: designators end in _U_WR_DWLINK3; ports I2C_A0=+3V3 I2C_A1=+3V3 I2C_A2=GND I2C_SCL=I2C_IO_SC1 I2C_SDA=I2C_IO_SD1 WR_DETECT=ARM_2V5_GPIO_PE3 WR_LED_ACTIVITY=FPGA_GPIO6 WR_LINK_SCL=I2C_DL_SC3 WR_LINK_SDA=I2C_DL_SD3 WR_LOS_TX_FAULT=FPGA_GPIO7
U_WR_DWLINK4: designators end in _U_WR_DWLINK4; ports I2C_A0=GND I2C_A1=GND I2C_A2=+3V3 I2C_SCL=I2C_IO_SC1 I2C_SDA=I2C_IO_SD1 WR_DETECT=ARM_2V5_GPIO_PE4 WR_LED_ACTIVITY=FPGA_GPIO8 WR_LINK_SCL=I2C_DL_SC4 WR_LINK_SDA=I2C_DL_SD4 WR_LOS_TX_FAULT=FPGA_GPIO9
U_WR_DWLINK5: designators end in _U_WR_DWLINK5; ports I2C_A0=+3V3 I2C_A1=GND I2C_A2=+3V3 I2C_SCL=I2C_IO_SC1 I2C_SDA=I2C_IO_SD1 WR_DETECT=ARM_2V5_GPIO_PE5 WR_LED_ACTIVITY=FPGA_GPIO10 WR_LINK_SCL=I2C_DL_SC5 WR_LINK_SDA=I2C_DL_SD5 WR_LOS_TX_FAULT=FPGA_GPIO11
U_WR_DWLINK8: designators end in _U_WR_DWLINK8; ports I2C_A0=GND I2C_A1=GND I2C_A2=GND I2C_SCL=I2C_IO_SC2 I2C_SDA=I2C_IO_SD2 WR_DETECT=ARM_2V5_GPIO_PE8 WR_LED_ACTIVITY=FPGA_GPIO16 WR_LINK_SCL=I2C_DL_SC8 WR_LINK_SDA=I2C_DL_SD8 WR_LOS_TX_FAULT=FPGA_GPIO17
U_WR_DWLINK11: designators end in _U_WR_DWLINK11; ports I2C_A0=+3V3 I2C_A1=+3V3 I2C_A2=GND I2C_SCL=I2C_IO_SC2 I2C_SDA=I2C_IO_SD2 WR_DETECT=ARM_2V5_GPIO_PE11 WR_LED_ACTIVITY=FPGA_GPIO22 WR_LINK_SCL=I2C_DL_SC11 WR_LINK_SDA=I2C_DL_SD11 WR_LOS_TX_FAULT=FPGA_GPIO23
U_WR_DWLINK14: designators end in _U_WR_DWLINK14; ports I2C_A0=GND I2C_A1=+3V3 I2C_A2=+3V3 I2C_SCL=I2C_IO_SC2 I2C_SDA=I2C_IO_SD2 WR_DETECT=ARM_2V5_GPIO_PE14 WR_LED_ACTIVITY=FPGA_GPIO28 WR_LINK_SCL=I2C_DL_SC14 WR_LINK_SDA=I2C_DL_SD14 WR_LOS_TX_FAULT=FPGA_GPIO29
U_WR_DWLINK17: designators end in _U_WR_DWLINK17; ports I2C_A0=+3V3 I2C_A1=GND I2C_A2=GND I2C_SCL=I2C_IO_SC0 I2C_SDA=I2C_IO_SD0 WR_DETECT=ARM_2V5_GPIO_PD11 WR_LED_ACTIVITY=FPGA_GPIO34 WR_LINK_SCL=ARM_3V3_GPIO_PB5 WR_LINK_SDA=ARM_3V3_GPIO_PB4 WR_LOS_TX_FAULT=FPGA_GPIO35
U_WR_DWLINK16: designators end in _U_WR_DWLINK16; ports I2C_A0=GND I2C_A1=GND I2C_A2=GND I2C_SCL=I2C_IO_SC0 I2C_SDA=I2C_IO_SD0 WR_DETECT=ARM_2V5_GPIO_PD10 WR_LED_ACTIVITY=FPGA_GPIO32 WR_LINK_SCL=ARM_3V3_GPIO_PB5 WR_LINK_SDA=ARM_3V3_GPIO_PB4 WR_LOS_TX_FAULT=FPGA_GPIO33
U_WR_DWLINK13: designators end in _U_WR_DWLINK13; ports I2C_A0=+3V3 I2C_A1=GND I2C_A2=+3V3 I2C_SCL=I2C_IO_SC2 I2C_SDA=I2C_IO_SD2 WR_DETECT=ARM_2V5_GPIO_PE13 WR_LED_ACTIVITY=FPGA_GPIO26 WR_LINK_SCL=I2C_DL_SC13 WR_LINK_SDA=I2C_DL_SD13 WR_LOS_TX_FAULT=FPGA_GPIO27
U_WR_DWLINK10: designators end in _U_WR_DWLINK10; ports I2C_A0=GND I2C_A1=+3V3 I2C_A2=GND I2C_SCL=I2C_IO_SC2 I2C_SDA=I2C_IO_SD2 WR_DETECT=ARM_2V5_GPIO_PE10 WR_LED_ACTIVITY=FPGA_GPIO20 WR_LINK_SCL=I2C_DL_SC10 WR_LINK_SDA=I2C_DL_SD10 WR_LOS_TX_FAULT=FPGA_GPIO21
U_WR_DWLINK7: designators end in _U_WR_DWLINK7; ports I2C_A0=+3V3 I2C_A1=+3V3 I2C_A2=+3V3 I2C_SCL=I2C_IO_SC1 I2C_SDA=I2C_IO_SD1 WR_DETECT=ARM_2V5_GPIO_PE7 WR_LED_ACTIVITY=FPGA_GPIO14 WR_LINK_SCL=I2C_DL_SC7 WR_LINK_SDA=I2C_DL_SD7 WR_LOS_TX_FAULT=FPGA_GPIO15
U_WR_DWLINK6: designators end in _U_WR_DWLINK6; ports I2C_A0=GND I2C_A1=+3V3 I2C_A2=+3V3 I2C_SCL=I2C_IO_SC1 I2C_SDA=I2C_IO_SD1 WR_DETECT=ARM_2V5_GPIO_PE6 WR_LED_ACTIVITY=FPGA_GPIO12 WR_LINK_SCL=I2C_DL_SC6 WR_LINK_SDA=I2C_DL_SD6 WR_LOS_TX_FAULT=FPGA_GPIO13
U_WR_DWLINK9: designators end in _U_WR_DWLINK9; ports I2C_A0=+3V3 I2C_A1=GND I2C_A2=GND I2C_SCL=I2C_IO_SC2 I2C_SDA=I2C_IO_SD2 WR_DETECT=ARM_2V5_GPIO_PE9 WR_LED_ACTIVITY=FPGA_GPIO18 WR_LINK_SCL=I2C_DL_SC9 WR_LINK_SDA=I2C_DL_SD9 WR_LOS_TX_FAULT=FPGA_GPIO19
U_WR_DWLINK12: designators end in _U_WR_DWLINK12; ports I2C_A0=GND I2C_A1=GND I2C_A2=+3V3 I2C_SCL=I2C_IO_SC2 I2C_SDA=I2C_IO_SD2 WR_DETECT=ARM_2V5_GPIO_PE12 WR_LED_ACTIVITY=FPGA_GPIO24 WR_LINK_SCL=I2C_DL_SC12 WR_LINK_SDA=I2C_DL_SD12 WR_LOS_TX_FAULT=FPGA_GPIO25
U_WR_DWLINK15: designators end in _U_WR_DWLINK15; ports I2C_A0=+3V3 I2C_A1=+3V3 I2C_A2=+3V3 I2C_SCL=I2C_IO_SC2 I2C_SDA=I2C_IO_SD2 WR_DETECT=ARM_2V5_GPIO_PE15 WR_LED_ACTIVITY=FPGA_GPIO30 WR_LINK_SCL=I2C_DL_SC15 WR_LINK_SDA=I2C_DL_SD15 WR_LOS_TX_FAULT=FPGA_GPIO31

### Notes on the sheet
- (in symbol LED_DIALIGHT_571-0132-100F, part A) BOT; Green
- (in symbol LED_DIALIGHT_571-0132-100F, part B) TOP; Red
- (in symbol LED_DIALIGHT_571-0133-100F, part A) BOT; Yellow
- (in symbol LED_DIALIGHT_571-0133-100F, part B) TOP; Yellow

### Library data of the parts
C46 = CC0603_100NF_16V_10%_X7R: Capacitor; Manufacturer1: AVX; Manufacturer1 PN: 0603YC104KAT2A; TC: X7R; Tolerance: ±10%; Voltage: 16V; Published: 8-Jun-2000; LatestRevisionDate: 17-Jul-2002; LatestRevisionNote: Re-released for DXP Platform.; PackageReference: RAD-0.3; Publisher: Altium Limited; Distributor1: Digikey; Distributor1 PN: 478-1239-1-ND; Case: 0603; Value: 100nF
LD1 = LED_DIALIGHT_571-0133-100F: LED x2 Yellow 1C2A-BOT_3C4A-TOP; Part Description: Dual 2mm Yellow LEDs CBI® Circuit Board Indicator (With positioning pins); Table: LEDs & Displays; Part Number: LED_DIALIGHT_571-0133-100F; Component Kind: Standard; Component Type: Standard; Color: Yellow/Yellow; PackageDescription: 2x 2mm Yellow LED PCB Edge Mounting (With positioning pins) DIALIGHT 571 Serie; Manufacturer: DIALIGHT; Manufacturer Part Number: 571-0133-100F; Pin Count: 4; Mounted: Yes; Socket: No; SMD: No; ComponentHeight: 8.6mm; HelpURL: \\cern.ch\dfs\Applications\Altium\Datasheets\LED_DIALIGHT_571-0133-100F.pdf; Author: CERN DEM JLC; CreateDate: 05/11/2009; LatestRevisionDate: 17/03/2010
LD2 = LED_DIALIGHT_571-0132-100F: 2x LED  Botom Green, Top Yellow; Part Description: Dual 2mm  LEDs, Yellow Top,Green Bot, CBI® Circuit Board Indicator (With positioning pins); Table: LEDs & Displays; Part Number: LED_DIALIGHT_571-0132-100F; Component Kind: Standard; Component Type: Standard; Color: Green/Yellow; PackageDescription: 2x 2mm LED (Top: Yellow, Bot: Green) PCB Edge Mounting (With positioning pins) DIALIGHT 571 Serie; Manufacturer: DIALIGHT; Manufacturer Part Number: 571-0132-100F; Pin Count: 4; Mounted: Yes; Socket: No; SMD: No; ComponentHeight: 8.6mm; HelpURL: \\cern.ch\dfs\Applications\Altium\Datasheets\LED_DIALIGHT_571-0132-100F.pdf; Author: CERN DEM JLC; CreateDate: 05/11/2009; LatestRevisionDate: 17/03/2010
R41-R44 = R0402_4.7K_±1%_0.1W_100PPM: SMD Resistor; Manufacturer1: Panasonic; Manufacturer1 PN: ERJ-2RKF4701X; TCR: 100ppm; Power Rating: 0.1W; Tolerance: ±1%; Case: 0402; Distributor1: DigiKey; Distributor1 PN: ERJ-2RKF4701X; Value: 4K7
R45 R48 R49 = R0603_4.7K_±1%_0.1W_100PPM: SMD Resistor; Manufacturer1: Panasonic; Manufacturer1 PN: ERJ-3EKF4701V; TCR: 100ppm; Power Rating: 0.1W; Tolerance: ±1%; Case: 0603; Distributor1: DigiKey; Distributor1 PN: P4.70KHCT-ND; Value: 4K7
R46 R47 R50 R51 = R0603_390R_±1%_0.1W_100PPM: SMD Resistor; Manufacturer1: Panasonic; Manufacturer1 PN: ERJ-3EKF3900V; TCR: 100ppm; Power Rating: 0.1W; Tolerance: ±1%; Case: 0603; Distributor1: DigiKey; Distributor1 PN: P390HCT-ND; Value: 390R
U7 = PCA9554D: 8-bit I2C-bus SMBus I/O port with interrupt; Manufacturer1 PN: PCA9554ATS,118; Manufacturer1: NXP Semiconductors; Distributor1: Digikey; Distributor1 PN: 568-2024-1-ND

## Sheet SFP.SchDoc
size A4
Used 18 times, as channels U_WR_DWLINK0/U_SFP, U_WR_DWLINK1/U_SFP, U_WR_DWLINK2/U_SFP, U_WR_DWLINK3/U_SFP, U_WR_DWLINK4/U_SFP, U_WR_DWLINK5/U_SFP, U_WR_DWLINK8/U_SFP, U_WR_DWLINK11/U_SFP, U_WR_DWLINK14/U_SFP, U_WR_DWLINK17/U_SFP, U_WR_DWLINK16/U_SFP, U_WR_DWLINK13/U_SFP, U_WR_DWLINK10/U_SFP, U_WR_DWLINK7/U_SFP, U_WR_DWLINK6/U_SFP, U_WR_DWLINK9/U_SFP, U_WR_DWLINK12/U_SFP, U_WR_DWLINK15/U_SFP. Parts and nets are listed once, with the designators drawn on the sheet.
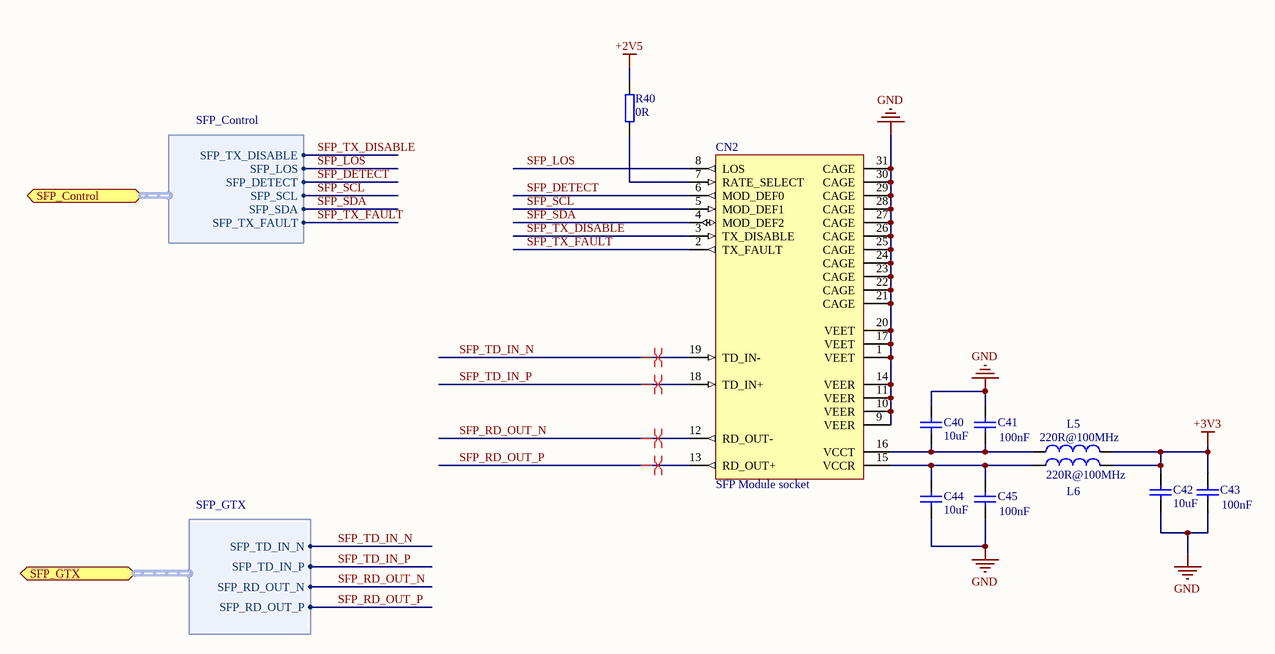
[diagram p3: SFP.SchDoc]

### Parts
C40  10uF  [CC1608-0603]
C41  100nF  [CC1005-0402]
C42  10uF  [CC1608-0603]
C43  100nF  [CC1005-0402]
C44  10uF  [CC1608-0603]
C45  100nF  [CC1005-0402]
CN2  SFP Module socket  [SFP_SINGLE_PORT]
L5  Impedance: 220R@100MHz  [0603]  (hidden comment: 220R@100MHz Ferrite Bead)
L6  Impedance: 220R@100MHz  [0603]  (hidden comment: 220R@100MHz Ferrite Bead)
R40  0R  [0603]

### Ports
SFP_Control (harness SFP_Control), SFP_GTX (harness SFP_GTX)

### Harnesses
SFP_GTX: SFP_TD_IN_N, SFP_TD_IN_P, SFP_RD_OUT_N, SFP_RD_OUT_P
SFP_Control: SFP_DETECT, SFP_LOS, SFP_SCL, SFP_SDA, SFP_TX_FAULT, SFP_TX_DISABLE

### Nets
+2V5: R40.1
+3V3: C42.1 C43.2 L5.2 L6.2
GND: C40.1 C41.2 C42.2 C43.1 C44.2 C45.1 CN2.1(VEET) CN2.9(VEER) CN2.10(VEER) CN2.11(VEER) CN2.14(VEER) CN2.17(VEET) CN2.20(VEET) CN2.21(CAGE) CN2.22(CAGE) CN2.23(CAGE) CN2.24(CAGE) CN2.25(CAGE) CN2.26(CAGE) CN2.27(CAGE) CN2.28(CAGE) CN2.29(CAGE) CN2.30(CAGE) CN2.31(CAGE)
SFP_DETECT: CN2.6(MOD_DEF0) ; port SFP_Control.SFP_DETECT
SFP_LOS: CN2.8(LOS) ; port SFP_Control.SFP_LOS
SFP_RD_OUT_N: CN2.12(RD_OUT-) ; port SFP_GTX.SFP_RD_OUT_N
SFP_RD_OUT_P: CN2.13(RD_OUT+) ; port SFP_GTX.SFP_RD_OUT_P
SFP_SCL: CN2.5(MOD_DEF1) ; port SFP_Control.SFP_SCL
SFP_SDA: CN2.4(MOD_DEF2) ; port SFP_Control.SFP_SDA
SFP_TD_IN_N: CN2.19(TD_IN-) ; port SFP_GTX.SFP_TD_IN_N
SFP_TD_IN_P: CN2.18(TD_IN+) ; port SFP_GTX.SFP_TD_IN_P
SFP_TX_DISABLE: CN2.3(TX_DISABLE) ; port SFP_Control.SFP_TX_DISABLE
SFP_TX_FAULT: CN2.2(TX_FAULT) ; port SFP_Control.SFP_TX_FAULT
NetC40_2: C40.2 C41.1 CN2.16(VCCT) L5.1
NetC44_1: C44.1 C45.2 CN2.15(VCCR) L6.1
NetCN2_7: CN2.7(RATE_SELECT) R40.2

### Channels
U_WR_DWLINK0/U_SFP: designators end in _U_WR_DWLINK0_U_SFP
U_WR_DWLINK1/U_SFP: designators end in _U_WR_DWLINK1_U_SFP
U_WR_DWLINK2/U_SFP: designators end in _U_WR_DWLINK2_U_SFP
U_WR_DWLINK3/U_SFP: designators end in _U_WR_DWLINK3_U_SFP
U_WR_DWLINK4/U_SFP: designators end in _U_WR_DWLINK4_U_SFP
U_WR_DWLINK5/U_SFP: designators end in _U_WR_DWLINK5_U_SFP
U_WR_DWLINK8/U_SFP: designators end in _U_WR_DWLINK8_U_SFP
U_WR_DWLINK11/U_SFP: designators end in _U_WR_DWLINK11_U_SFP
U_WR_DWLINK14/U_SFP: designators end in _U_WR_DWLINK14_U_SFP
U_WR_DWLINK17/U_SFP: designators end in _U_WR_DWLINK17_U_SFP
U_WR_DWLINK16/U_SFP: designators end in _U_WR_DWLINK16_U_SFP
U_WR_DWLINK13/U_SFP: designators end in _U_WR_DWLINK13_U_SFP
U_WR_DWLINK10/U_SFP: designators end in _U_WR_DWLINK10_U_SFP
U_WR_DWLINK7/U_SFP: designators end in _U_WR_DWLINK7_U_SFP
U_WR_DWLINK6/U_SFP: designators end in _U_WR_DWLINK6_U_SFP
U_WR_DWLINK9/U_SFP: designators end in _U_WR_DWLINK9_U_SFP
U_WR_DWLINK12/U_SFP: designators end in _U_WR_DWLINK12_U_SFP
U_WR_DWLINK15/U_SFP: designators end in _U_WR_DWLINK15_U_SFP

### Layout directives
differential pair: MGTRX112_0_N, MGTRX112_0_P, MGTTX112_0_N, MGTTX112_0_P

### Library data of the parts
C40 C42 C44 = CC0603_10UF_6.3V_20%_X5R: Capacitor; Manufacturer1: TDK; Manufacturer1 PN: C1608X5R0J106M; TC: X5R; Tolerance: ±20%; Voltage: 6.3V; Published: 8-Jun-2000; LatestRevisionDate: 17-Jul-2002; LatestRevisionNote: Re-released for DXP Platform.; PackageReference: RAD-0.3; Publisher: Altium Limited; Distributor1: Digikey; Distributor1 PN: 445-4112-1-ND; Case: 0603; Value: 10uF
C41 C43 C45 = CC0402_100NF_16V_10%_X7R: Capacitor; Manufacturer1: TDK; Manufacturer1 PN: C1005X7R1C104K; TC: X7R; Tolerance: ±10%; Voltage: 16V; Published: 8-Jun-2000; LatestRevisionDate: 17-Jul-2002; LatestRevisionNote: Re-released for DXP Platform.; PackageReference: RAD-0.3; Publisher: Altium Limited; Distributor1: Digikey; Distributor1 PN: 445-4952-1-ND; Case: 0402; Value: 100nF
CN2 = SFP_SOCKET_SINGLE: Socket for SFP module; RefId: Far/1256176
L5 L6 = L_FERRITE_BEAD: ferrite bead; Manufacturer1: Murata; Manufacturer1 PN: BLM18KG221SN1D; Current Rating: 2.2A; DCR: 50mOhm; Case: 0603; Distributor1: Digikey; Distributor1 PN: 490-5255-1-ND
R40 = R0603_0R_0.1W_JUMPER: SMD Resistor; Manufacturer1: Yageo; Manufacturer1 PN: RC0603JR-070RL; TCR: 200ppm; Power Rating: 0.1W; Case: 0603; Distributor1: DigiKey; Distributor1 PN: 311-0.0GRCT-ND; Tolerance: -; Value: 0R

## Sheet I2C_Multiplexers.SchDoc
size A4 portrait
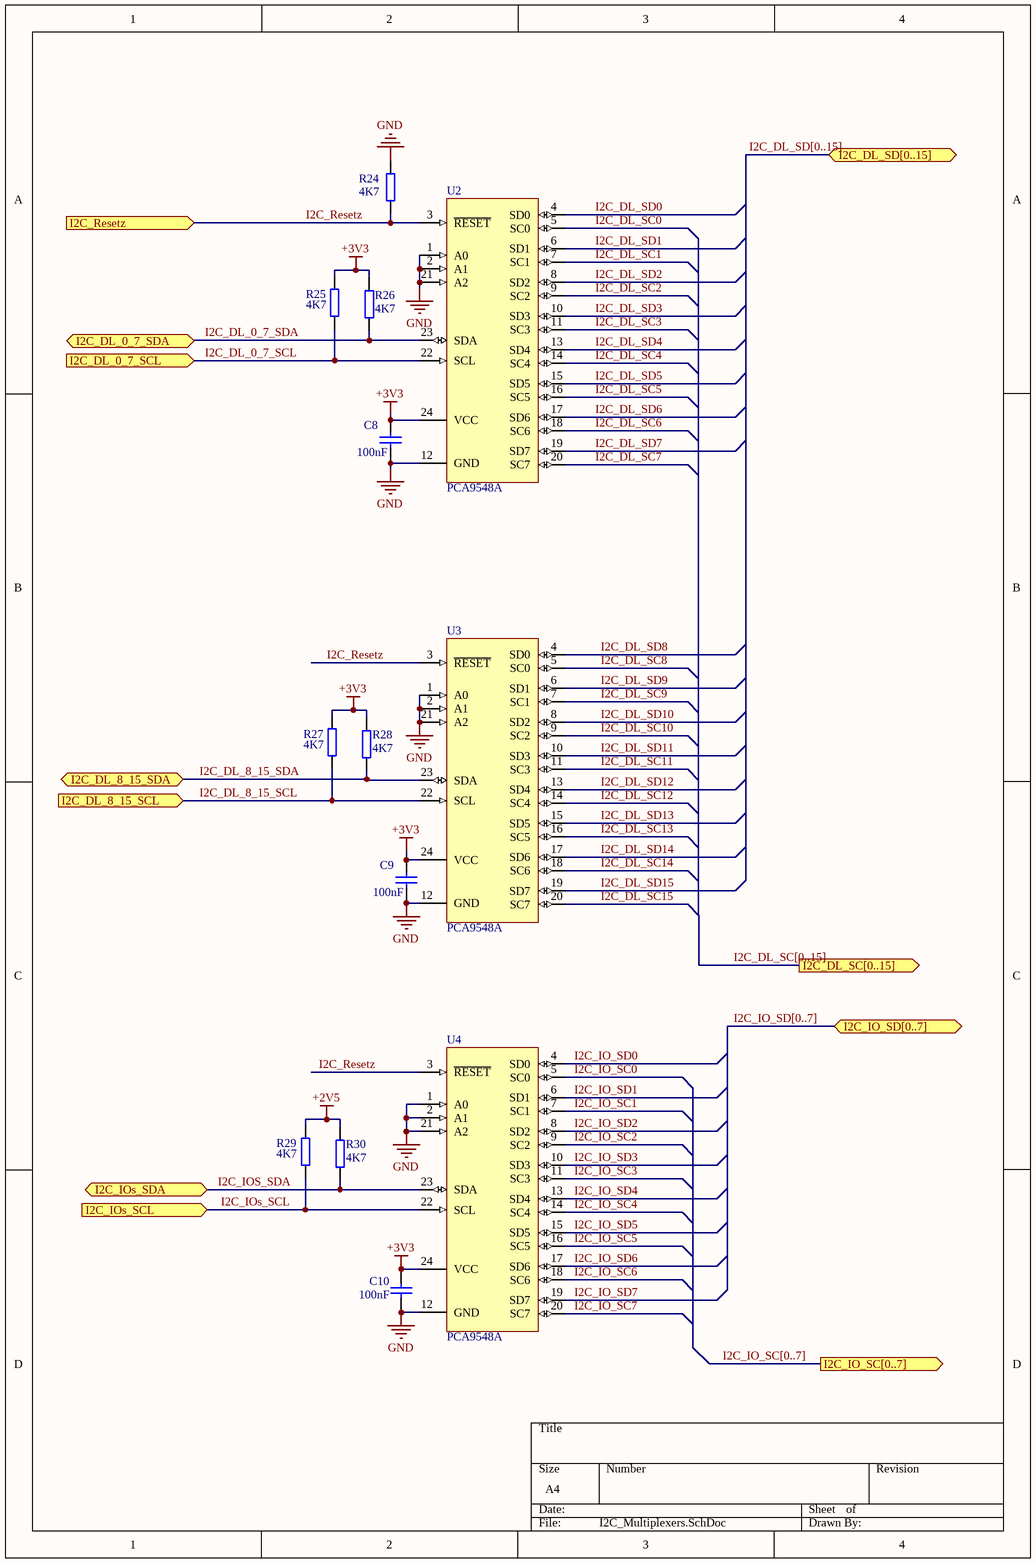
[diagram p4: I2C_Multiplexers.SchDoc]

### Parts
C8  100nF  [CC1608-0603]
C9  100nF  [CC1608-0603]
C10  100nF  [CC1608-0603]
R24  4K7  [0603]
R25  4K7  [0603]
R26  4K7  [0603]
R27  4K7  [0603]
R28  4K7  [0603]
R29  4K7  [0603]
R30  4K7  [0603]
U2  PCA9548A  [SOP65P640X120-24N]
U3  PCA9548A  [SOP65P640X120-24N]
U4  PCA9548A  [SOP65P640X120-24N]

### Ports
I2C_DL_0_7_SCL (in), I2C_DL_0_7_SDA (bidir), I2C_DL_8_15_SCL (in), I2C_DL_8_15_SDA (bidir), I2C_DL_SC[0..15] (out), I2C_DL_SD[0..15] (bidir), I2C_IO_SC[0..7] (out), I2C_IO_SD[0..7] (bidir), I2C_IOs_SCL (in), I2C_IOs_SDA (bidir), I2C_Resetz (in)

### Nets
+2V5: R29.1 R30.1
+3V3: C8.2 C9.2 C10.1 R25.1 R26.1 R27.1 R28.1 U2.24(VCC) U3.24(VCC) U4.24(VCC)
GND: C8.1 C9.1 C10.2 R24.2 U2.1(A0) U2.2(A1) U2.12(GND) U2.21(A2) U3.1(A0) U3.2(A1) U3.12(GND) U3.21(A2) U4.1(A0) U4.2(A1) U4.12(GND) U4.21(A2)
I2C_DL_0_7_SCL: R25.2 U2.22(SCL) ; port I2C_DL_0_7_SCL  [project net ARM_3V3_GPIO_PB1]
I2C_DL_0_7_SDA: R26.2 U2.23(SDA) ; port I2C_DL_0_7_SDA  [project net ARM_3V3_GPIO_PB0]
I2C_DL_8_15_SCL: R27.2 U3.22(SCL) ; port I2C_DL_8_15_SCL  [project net ARM_3V3_GPIO_PB2]
I2C_DL_8_15_SDA: R28.2 U3.23(SDA) ; port I2C_DL_8_15_SDA  [project net ARM_3V3_GPIO_PB3]
I2C_DL_SC0: U2.5(SC0)
I2C_DL_SC1: U2.7(SC1)
I2C_DL_SC2: U2.9(SC2)
I2C_DL_SC3: U2.11(SC3)
I2C_DL_SC4: U2.14(SC4)
I2C_DL_SC5: U2.16(SC5)
I2C_DL_SC6: U2.18(SC6)
I2C_DL_SC7: U2.20(SC7)
I2C_DL_SC8: U3.5(SC0)
I2C_DL_SC9: U3.7(SC1)
I2C_DL_SC10: U3.9(SC2)
I2C_DL_SC11: U3.11(SC3)
I2C_DL_SC12: U3.14(SC4)
I2C_DL_SC13: U3.16(SC5)
I2C_DL_SC14: U3.18(SC6)
I2C_DL_SC15: U3.20(SC7)
I2C_DL_SD0: U2.4(SD0)
I2C_DL_SD1: U2.6(SD1)
I2C_DL_SD2: U2.8(SD2)
I2C_DL_SD3: U2.10(SD3)
I2C_DL_SD4: U2.13(SD4)
I2C_DL_SD5: U2.15(SD5)
I2C_DL_SD6: U2.17(SD6)
I2C_DL_SD7: U2.19(SD7)
I2C_DL_SD8: U3.4(SD0)
I2C_DL_SD9: U3.6(SD1)
I2C_DL_SD10: U3.8(SD2)
I2C_DL_SD11: U3.10(SD3)
I2C_DL_SD12: U3.13(SD4)
I2C_DL_SD13: U3.15(SD5)
I2C_DL_SD14: U3.17(SD6)
I2C_DL_SD15: U3.19(SD7)
I2C_IO_SC0: U4.5(SC0)
I2C_IO_SC1: U4.7(SC1)
I2C_IO_SC2: U4.9(SC2)
I2C_IO_SC3: U4.11(SC3)
I2C_IO_SC4: U4.14(SC4)
I2C_IO_SC5: U4.16(SC5)
I2C_IO_SC6: U4.18(SC6)
I2C_IO_SC7: U4.20(SC7)
I2C_IO_SD0: U4.4(SD0)
I2C_IO_SD1: U4.6(SD1)
I2C_IO_SD2: U4.8(SD2)
I2C_IO_SD3: U4.10(SD3)
I2C_IO_SD4: U4.13(SD4)
I2C_IO_SD5: U4.15(SD5)
I2C_IO_SD6: U4.17(SD6)
I2C_IO_SD7: U4.19(SD7)
I2C_IOs_SCL: R29.2 U4.22(SCL) ; port I2C_IOs_SCL
I2C_IOS_SDA: R30.2 U4.23(SDA) ; port I2C_IOs_SDA
I2C_Resetz: R24.1 U2.3(~{RESET}) U3.3(~{RESET}) U4.3(~{RESET}) ; port I2C_Resetz  [project net ARM_2V5_GPIO_PD12]

### Buses and harness runs
bus I2C_DL_SC[0..15] = port I2C_DL_SC[0..15]
bus I2C_DL_SD[0..15] = port I2C_DL_SD[0..15]
bus I2C_IO_SC[0..7] = port I2C_IO_SC[0..7]
bus I2C_IO_SD[0..7] = port I2C_IO_SD[0..7]

### Library data of the parts
C8-C10 = CC0603_100NF_16V_10%_X7R: as C46 on sheet WR_LINK; Published: 8-Jun-2000; LatestRevisionDate: 17-Jul-2002; LatestRevisionNote: Re-released for DXP Platform.; PackageReference: RAD-0.3; Publisher: Altium Limited; Distributor1: Digikey; Distributor1 PN: 478-1239-1-ND; Case: 0603; Value: 100nF
R24-R30 = R0603_4.7K_±1%_0.1W_100PPM: as R45 on sheet WR_LINK; Case: 0603; Distributor1: DigiKey; Distributor1 PN: P4.70KHCT-ND; Value: 4K7
U2-U4 = PCA9548A: 8-channel 2C-bus switch with reset; Manufacturer1 PN: PCA9548APW,112; Manufacturer1: NXP Semiconductors; Distributor1: Digikey; Distributor1 PN: 568-3384-5-ND

## Sheet Connectors_GPIOs.SchDoc
size A3
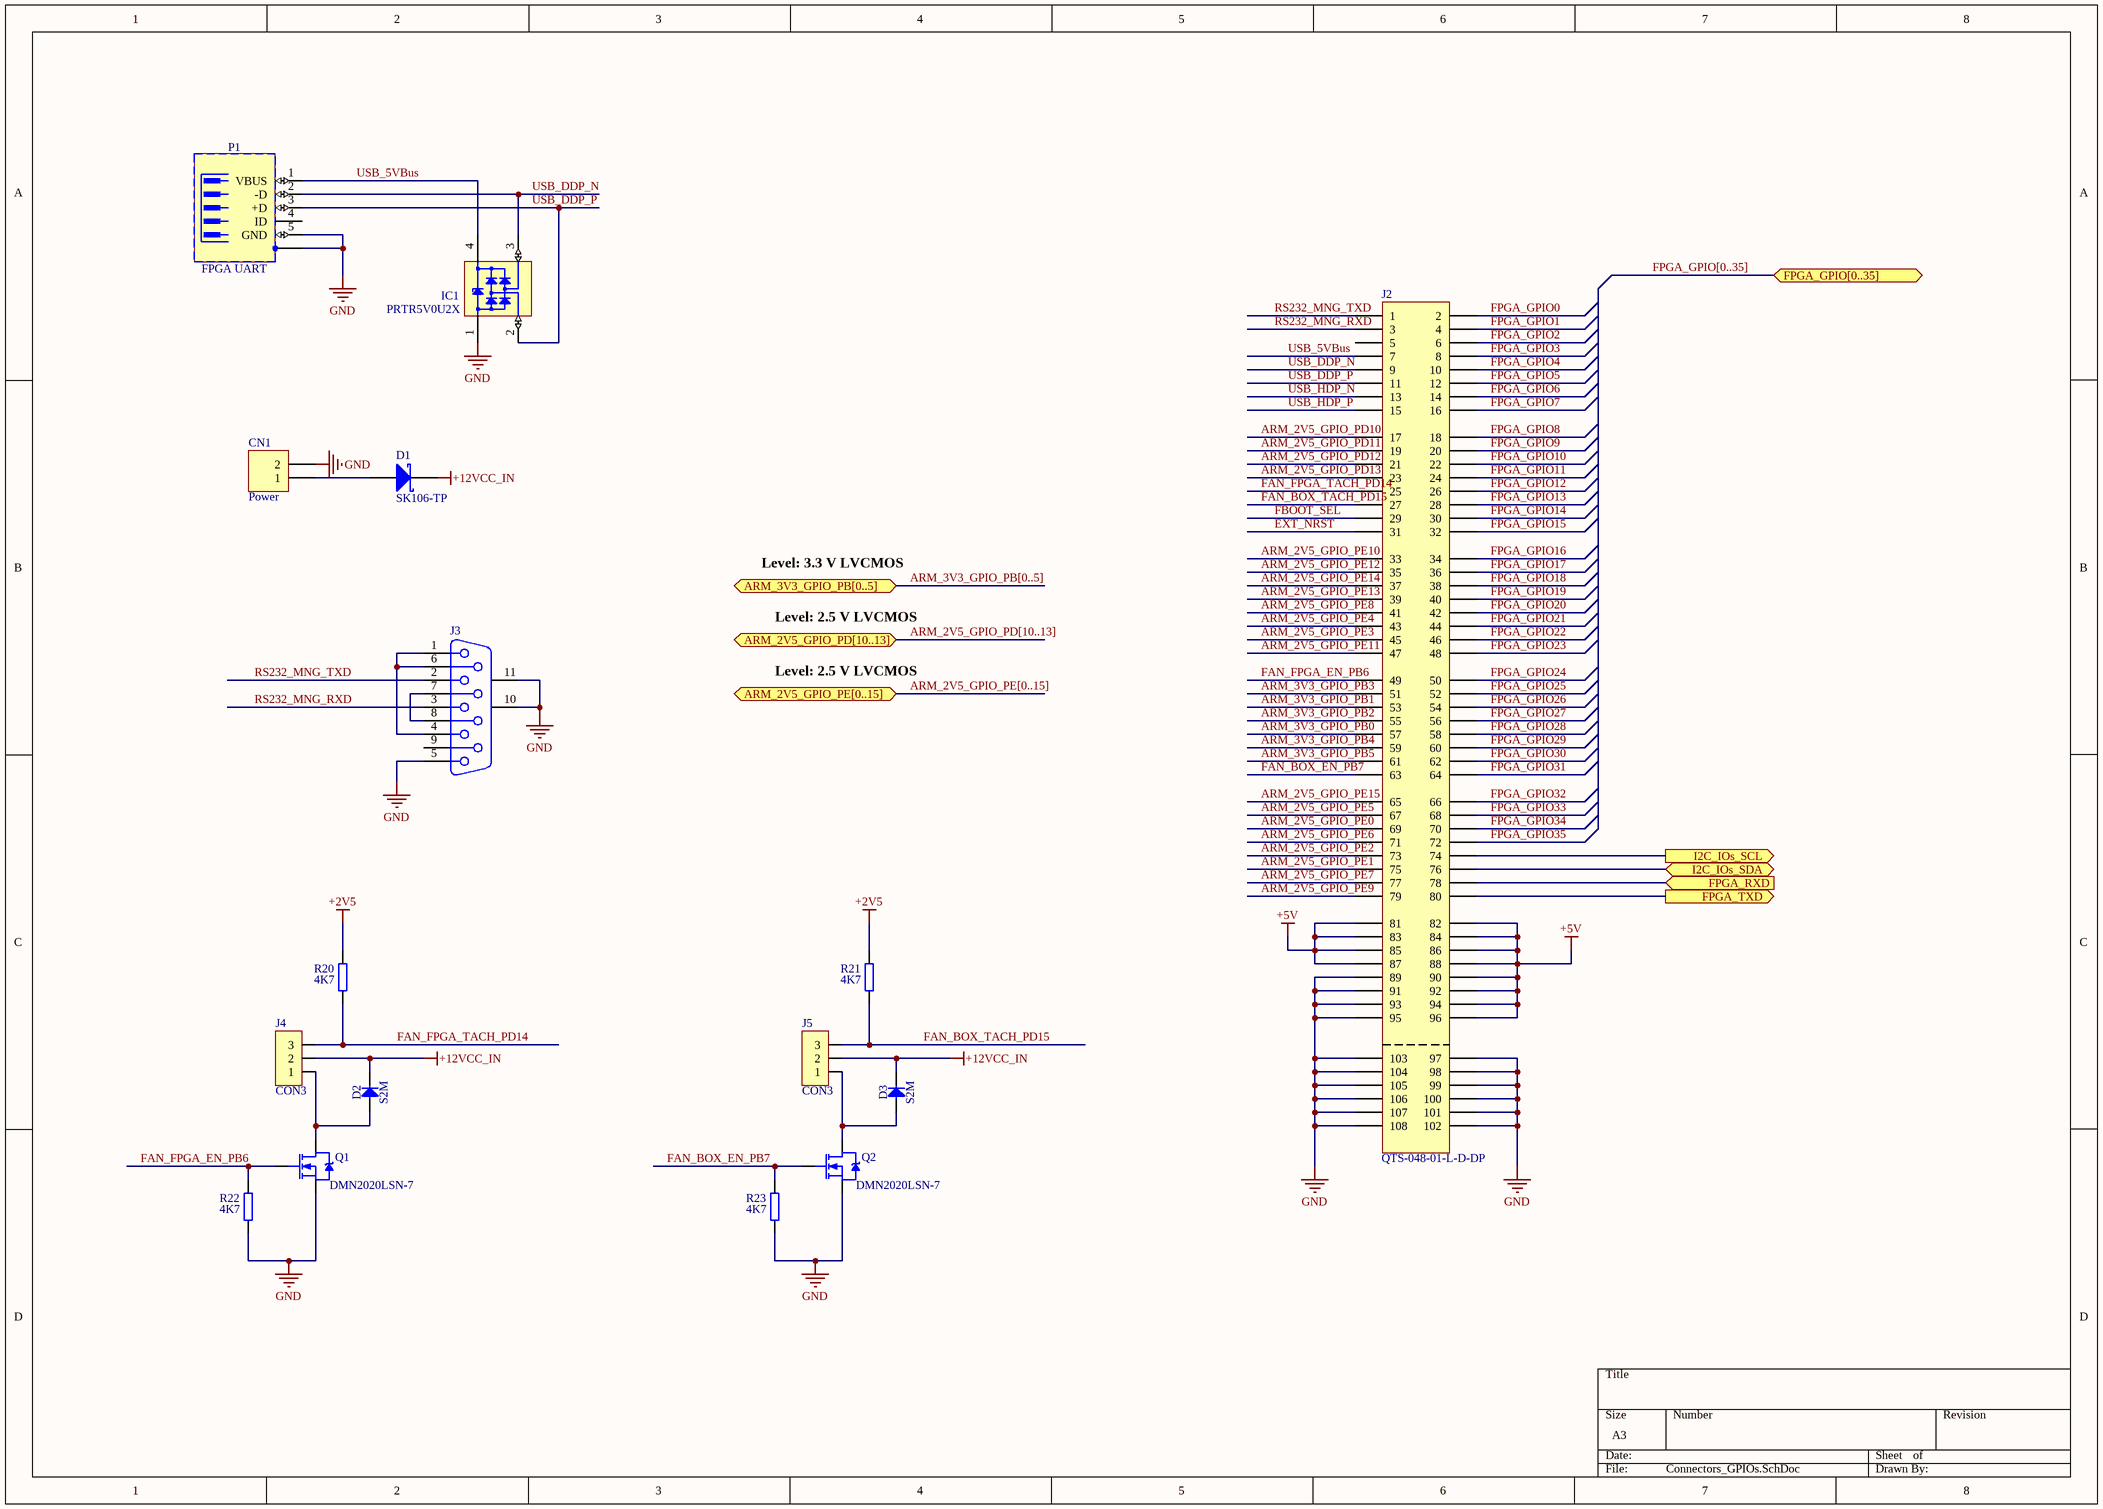
[diagram p5: Connectors_GPIOs.SchDoc]

### Parts
CN1  Power
D1  SK106-TP  [DIOM7959X262N]
D2  S2M  [DIOM5336X265N]
D3  S2M  [DIOM5336X265N]
IC1  PRTR5V0U2X  [SOT190P230X110-4N]
J2  QTS-048-01-L-D-DP  [QTS-048-XX-X-D-DP-A]
J3  D Connector 9  [DSUB1.385-2H9]  (value not drawn)
J4  CON3  [HDR1X3]
J5  CON3  [HDR1X3]
P1  FPGA UART  [TYCO_1734035-1]
Q1  DMN2020LSN-7  [SC-59-3]
Q2  DMN2020LSN-7  [SC-59-3]
R20  4K7  [0603]
R21  4K7  [0603]
R22  4K7  [0603]
R23  4K7  [0603]

### Ports
ARM_2V5_GPIO_PD[10..13] (bidir), ARM_2V5_GPIO_PE[0..15] (bidir), ARM_3V3_GPIO_PB[0..5] (bidir), FPGA_GPIO[0..35] (bidir), FPGA_RXD (in), FPGA_TXD (out), I2C_IOs_SCL (out), I2C_IOs_SDA (bidir)

### Nets
+2V5: R20.1 R21.1
+5V: J2.81 J2.82 J2.83 J2.84 J2.85 J2.86 J2.87 J2.88 J2.90 J2.92 J2.94 J2.96
+12VCC_IN: D1.2(K) D2.1(C) D3.1(C) J4.2 J5.2
GND: CN1.2 IC1.1(GND) J2.89 J2.91 J2.93 J2.95 J2.97 J2.98 J2.99 J2.100 J2.101 J2.102 J2.103 J2.104 J2.105 J2.106 J2.107 J2.108 J3.5 J3.10(MH1) J3.11(MH2) P1.5(GND) P1.6(SH) Q1.3(S) Q2.3(S) R22.2 R23.2
ARM_2V5_GPIO_PD10: J2.17
ARM_2V5_GPIO_PD11: J2.19
ARM_2V5_GPIO_PD12: J2.21
ARM_2V5_GPIO_PD13: J2.23
ARM_2V5_GPIO_PE0: J2.69
ARM_2V5_GPIO_PE1: J2.75
ARM_2V5_GPIO_PE2: J2.73
ARM_2V5_GPIO_PE3: J2.45
ARM_2V5_GPIO_PE4: J2.43
ARM_2V5_GPIO_PE5: J2.67
ARM_2V5_GPIO_PE6: J2.71
ARM_2V5_GPIO_PE7: J2.77
ARM_2V5_GPIO_PE8: J2.41
ARM_2V5_GPIO_PE9: J2.79
ARM_2V5_GPIO_PE10: J2.33
ARM_2V5_GPIO_PE11: J2.47
ARM_2V5_GPIO_PE12: J2.35
ARM_2V5_GPIO_PE13: J2.39
ARM_2V5_GPIO_PE14: J2.37
ARM_2V5_GPIO_PE15: J2.65
ARM_3V3_GPIO_PB0: J2.57
ARM_3V3_GPIO_PB1: J2.53
ARM_3V3_GPIO_PB2: J2.55
ARM_3V3_GPIO_PB3: J2.51
ARM_3V3_GPIO_PB4: J2.59
ARM_3V3_GPIO_PB5: J2.61
EXT_NRST: J2.31
FAN_BOX_EN_PB7: J2.63 Q2.1(G) R23.1
FAN_BOX_TACH_PD15: J2.27 J5.3 R21.2
FAN_FPGA_EN_PB6: J2.49 Q1.1(G) R22.1
FAN_FPGA_TACH_PD14: J2.25 J4.3 R20.2
FBOOT_SEL: J2.29
FPGA_GPIO0: J2.2
FPGA_GPIO1: J2.4
FPGA_GPIO2: J2.6
FPGA_GPIO3: J2.8
FPGA_GPIO4: J2.10
FPGA_GPIO5: J2.12
FPGA_GPIO6: J2.14
FPGA_GPIO7: J2.16
FPGA_GPIO8: J2.18
FPGA_GPIO9: J2.20
FPGA_GPIO10: J2.22
FPGA_GPIO11: J2.24
FPGA_GPIO12: J2.26
FPGA_GPIO13: J2.28
FPGA_GPIO14: J2.30
FPGA_GPIO15: J2.32
FPGA_GPIO16: J2.34
FPGA_GPIO17: J2.36
FPGA_GPIO18: J2.38
FPGA_GPIO19: J2.40
FPGA_GPIO20: J2.42
FPGA_GPIO21: J2.44
FPGA_GPIO22: J2.46
FPGA_GPIO23: J2.48
FPGA_GPIO24: J2.50
FPGA_GPIO25: J2.52
FPGA_GPIO26: J2.54
FPGA_GPIO27: J2.56
FPGA_GPIO28: J2.58
FPGA_GPIO29: J2.60
FPGA_GPIO30: J2.62
FPGA_GPIO31: J2.64
FPGA_GPIO32: J2.66
FPGA_GPIO33: J2.68
FPGA_GPIO34: J2.70
FPGA_GPIO35: J2.72
I2C_IOs_SCL: J2.74 ; port I2C_IOs_SCL
I2C_IOS_SDA: J2.76 ; port I2C_IOs_SDA
RS232_MNG_RXD: J2.3 J3.3
RS232_MNG_TXD: J2.1 J3.2
USB_5VBus: IC1.4(VCC) J2.7 P1.1(VBUS)
USB_DDP_N: IC1.3(I/O2) J2.9 P1.2(-D)
USB_DDP_P: IC1.2(I/O1) J2.11 P1.3(+D)
USB_HDP_N: J2.13
USB_HDP_P: J2.15
NetCN1_1: CN1.1 D1.1(A)
NetD2_2: D2.2(A) J4.1 Q1.2(D)
NetD3_2: D3.2(A) J5.1 Q2.2(D)
NetIC2_25: J2.80 ; port FPGA_TXD
NetJ2_78: J2.78 ; port FPGA_RXD
NetJ3_1: J3.1 J3.4 J3.6
NetJ3_7: J3.7 J3.8

Not connected (* = marked no-connect by the designer): J2 5; J3 9; P1 4(ID)

### Buses and harness runs
bus ARM_2V5_GPIO_PD[10..13] = port ARM_2V5_GPIO_PD[10..13]
bus ARM_2V5_GPIO_PE[0..15] = port ARM_2V5_GPIO_PE[0..15]
bus ARM_3V3_GPIO_PB[0..5] = port ARM_3V3_GPIO_PB[0..5]
bus FPGA_GPIO[0..35] = port FPGA_GPIO[0..35]

### Notes on the sheet
- Level: 3.3 V LVCMOS
- Level: 2.5 V LVCMOS

### Library data of the parts
CN1 = Header 2: Header, 2-Pin; Manufacturer1 PN: 794120-1; Manufacturer1: Tyco Electronics; LatestRevisionDate: 17-Jul-2002; LatestRevisionNote: Re-released for DXP Platform.; Publisher: Altium Limited; Distributor1: Digikey; Distributor1 PN: A25753-ND
D1 = SK106-TP: Schottky Diode 10A 60V; Manufacturer1: Micro Commercial Components; Distributor1 PN: Digikey; Manufacturer1 PN: SK106-TP; Distributor1 PN: SK106-TPCT-ND
D2 D3 = S2M: Diode; Part Description: General Purpose Rectifiers (Glass Passivated); Manufacturer: FAIRCHILD SEMICONDUCTOR; Voltage: 1000V; Power: 2A; Table: Diodes; Part Number: S2M; Component Kind: Standard; Component Type: Standard; Device: S2M; PackageDescription: DO-214-AA/SMB Diode, Molded Body; 5.34mm L X 3.625mm W X 2.65mm H, IPC Medium Density; Manufacturer Part Number: S2M; Pin Count: 2; Case: DO-214AA; Mounted: Yes; Socket: No; SMD: Yes; ComponentHeight: 2.65mm; HelpURL: \\cern.ch\dfs\Applications\Altium\Datasheets\S2M.pdf; Author: CERN DEM JLC; CreateDate: 4/26/2011; LatestRevisionDate: 4/26/2011
IC1 = PRTR5V0U2X: Ultra Low Capacitance Double Rail-to-Rail ESD Protection Diode; Part Description: Ultra Low Capacitance (1pF) Double Rail-to-Rail ESD Protection Diode (8kV); Manufacturer: PHILIPS NXP; Voltage: 5.5V; Table: Diodes; Part Number: PRTR5V0U2X; Component Kind: Standard; Component Type: Standard; Device: PRTR5V0U2X; PackageDescription: SOT143B, SOT, 1.90mm Pitch; 4 Pin, 1.30mm W X 2.90mm L X 1.10mm H body, IPC Medium Density; Manufacturer Part Number: PRTR5V0U2X; Pin Count: 4; Case: SOT143B; Mounted: Yes; Socket: No; SMD: Yes; ComponentHeight: 1.1mm; HelpURL: \\cern.ch\dfs\Applications\Altium\Datasheets\PRTR5V0U2X.pdf; Author: CERN DEM JLC; CreateDate: 3/22/2011; LatestRevisionDate: 3/22/2011
J2 = QTS-048-01-L-D-DP: as J1 on sheet Connector_GTX; Manufacturer1 PN: QTS-048-01-L-D-DP
J3 = D Connector 9: Receptacle Assembly, 9 Position, Right Angle; Manufacturer1 PN: 1734348-1; Manufacturer1: TE Connectivity; PackageDocument: O; Positions: 9; Published: 15-Jun-2001; LatestRevisionDate: 17-Jul-2002; LatestRevisionNote: Re-released for DXP Platform.; DatasheetDocument: 1-Sep-1999; PackageReference: 788750; Publisher: Altium Limited; Orientation: Right Angle; Gender: Receptacle; Distributor1: Digikey; Distributor1 PN: A35109-ND
J4 J5 = CON3: Connector; Manufacturer1: Molex; Distributor1: Digikey; Distributor1 PN: WM2701-ND; Manufacturer1 PN: 22-11-2032
P1 = TYCO_1734035-1: 5 Pin + 1 Shield USB Receptacle; Part Description: 5 Position, Right Angle, SMD Mini USB Type B Receptacle; Manufacturer: TYCO ELECTRONICS; Table: TYCO; Part Number: TYCO_1734035-1; Component Kind: Standard; Component Type: Standard; Pin Count: 6; Family: USB; Mounted: Yes; Socket: No; SMD: Yes; Status: None; Manufacturer Part Number: 1734035-1; ComponentHeight: 3.95mm; HelpURL: \\cern.ch\dfs\Applications\Altium\Datasheets\TYCO_1734035-1.pdf; Author: CERN DEM JLC; CreateDate: 02/05/2011; LatestRevisionDate: 02/05/2011
Q1 Q2 = DMN2020LSN-7: N-Channel Power MOSFET; Manufacturer: Diodes Inc.; Published: 8-Jun-2000; LatestRevisionDate: 17-Jul-2002; LatestRevisionNote: Re-released for DXP Platform.; DatasheetVersion: PD-9.814; Publisher: Altium Limited; ComponentLink1Description: Manufacturer Link; ComponentLink1URL: http://www.irf.com/; Value: DMN2020LSN-7; Distributor1: Digikey; Distributor1 PN: DMN2020LSN-7DICT-ND
R20-R23 = R0603_4.7K_±1%_0.1W_100PPM: as R45 on sheet WR_LINK; Case: 0603; Distributor1: DigiKey; Distributor1 PN: P4.70KHCT-ND; Value: 4K7